# Altium project OBC-CubeSat-REV-A.PrjPcb
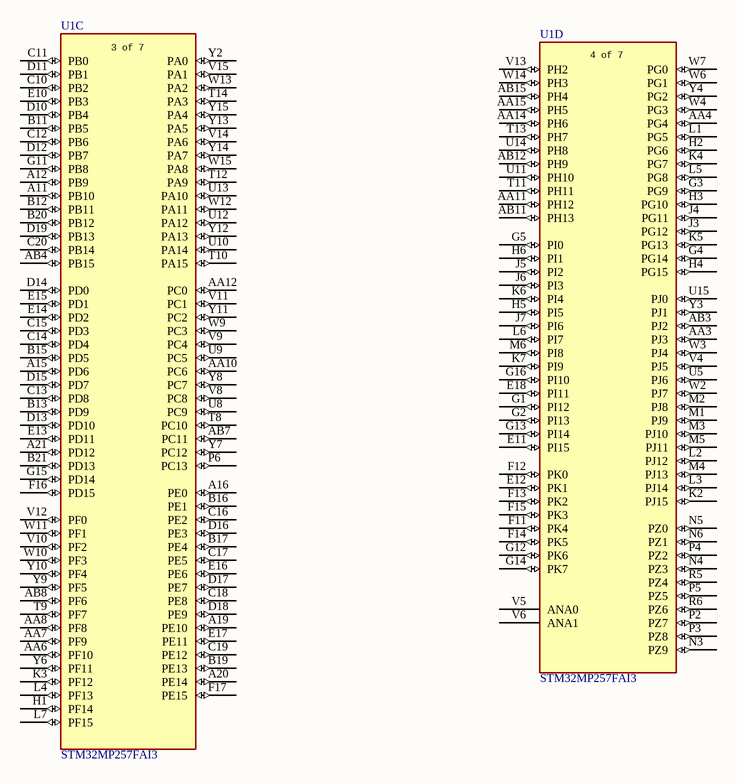
[diagram p0: MPU.SchDoc]
11 sheets, 184 parts. Net scope: global (net labels, ports and power ports of the same name join across sheets).
Board file: OBC-QM.PcbDoc
Sheets:
  MPU.SchDoc
  MPU-Power.SchDoc
  PMIC.SchDoc
  DebugInterface.SchDoc
  LPDDR4.SchDoc
  ETH-Debug.SchDoc
  RS485-Interface.SchDoc
  EXT-Camera-Interface.SchDoc
  Memory.SchDoc
  Sensors.SchDoc
  Harness.SchDoc

## Sheet MPU.SchDoc
size A4; SheetNumber: 1; SheetTotal: 11

### Parts
U1  STM32MP257FAI3  [TFBGA436_STM]  (parts C,D of 8)

### Nets

Not connected (* = marked no-connect by the designer): U1 A11(PB10) A12(PB9) A15(PD6) A16(PE0) A19(PE10) A20(PE14) A21(PD12) AA3(PJ3) AA4(PG4) AA6(PF10) AA7(PF9) AA8(PF8) AA10(PC6) AA11(PH12) AA12(PC0) AA14(PH6) AA15(PH5) AB3(PJ2) AB4(PB15) AB7(PC11) AB8(PF6) AB11(PH13) AB12(PH9) AB15(PH4) B11(PB5) B12(PB11) B13(PD9) B15(PD5) B16(PE1) B17(PE4) B19(PE13) B20(PB12) B21(PD13) C10(PB2) C11(PB0) C12(PB6) C13(PD8) C14(PD4) C15(PD3) C16(PE2) C17(PE5) C18(PE8) C19(PE12) C20(PB14) D10(PB4) D11(PB1) D12(PB7) D13(PD10) D14(PD0) D15(PD7) D16(PE3) D17(PE7) D18(PE9) D19(PB13) E10(PB3) E11(PI15) E12(PK1) E13(PD11) E14(PD2) E15(PD1) E16(PE6) E17(PE11) E18(PI11) F11(PK4) F12(PK0) F13(PK2) F14(PK5) F15(PK3) F16(PD15) F17(PE15) G1(PI12) G2(PI13) G3(PG9) G4(PG14) G5(PI0) G11(PB8) G12(PK6) G13(PI14) G14(PK7) G15(PD14) G16(PI10) H1(PF14) H2(PG6) H3(PG10) H4(PG15) H5(PI5) H6(PI1) J3(PG12) J4(PG11) J5(PI2) J6(PI3) J7(PI6) K2(PJ15) K3(PF12) K4(PG7) K5(PG13) K6(PI4) K7(PI9) L1(PG5) L2(PJ12) L3(PJ14) L4(PF13) L5(PG8) L6(PI7) L7(PF15) M1(PJ9) M2(PJ8) M3(PJ10) M4(PJ13) M5(PJ11) M6(PI8) N3(PZ9) N4(PZ3) N5(PZ0) N6(PZ1) P2(PZ7) P3(PZ8) P4(PZ2) P5(PZ5) P6(PC13) R5(PZ4) R6(PZ6) T8(PC10) T9(PF7) T10(PA15) T11(PH11) T12(PA9) T13(PH7) T14(PA3) U5(PJ6) U8(PC9) U9(PC5) U10(PA14) U11(PH10) U12(PA12) U13(PA10) U14(PH8) U15(PJ0) V4(PJ5) V5(ANA0) V6(ANA1) V8(PC8) V9(PC4) V10(PF2) V11(PC1) V12(PF0) V13(PH2) V14(PA6) V15(PA1) W2(PJ7) W3(PJ4) W4(PG3) W6(PG1) W7(PG0) W9(PC3) W10(PF3) W11(PF1) W12(PA11) W13(PA2) W14(PH3) W15(PA8) Y2(PA0) Y3(PJ1) Y4(PG2) Y6(PF11) Y7(PC12) Y8(PC7) Y9(PF5) Y10(PF4) Y11(PC2) Y12(PA13) Y13(PA5) Y14(PA7) Y15(PA4)

### Notes on the sheet
- (in symbol STM32MP257FAI3, part C) 3 of 7
- (in symbol STM32MP257FAI3, part D) 4 of 7

### Library data of the parts
U1 = STM32MP257FAI3: MPU with Dual Arm Cortex-A35 @1.5GHz, Cortex-M33 @400MHz, 3xEthernet (2+1 switch), 3xFD-CAN, LVDS/DSI, H.264, 3D GPU, AI/NN, Secure Boot, Cryptography, DRAM enc/dec, PKA; Manufacturer_Name: STMicroelectronics; Copyright: Copyright (C) 2025 Ultra Librarian. All rights reserved.; Manufacturer_Part_Number: STM32MP257FAI3; RefDes: RefDes; Type: Type

## Sheet MPU-Power.SchDoc
size A4; SheetNumber: 2; SheetTotal: 10
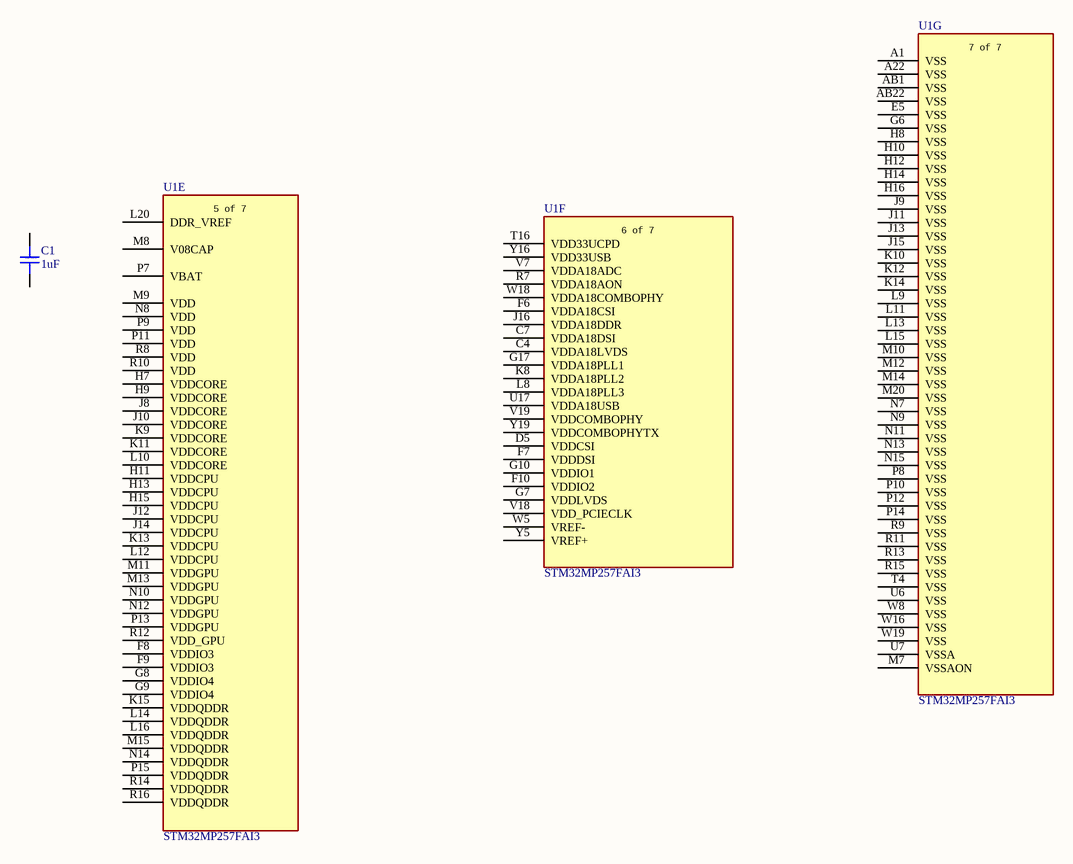
[diagram p1: MPU-Power.SchDoc]

### Parts
C1  1uF  [CAP_0402]
U1  STM32MP257FAI3  [TFBGA436_STM]  (parts E,F,G of 8)

### Nets

Not connected (* = marked no-connect by the designer): C1 1 2; U1 A1(VSS) A22(VSS) AB1(VSS) AB22(VSS) C4(VDDA18LVDS) C7(VDDA18DSI) D5(VDDCSI) E5(VSS) F6(VDDA18CSI) F7(VDDDSI) F8(VDDIO3) F9(VDDIO3) F10(VDDIO2) G6(VSS) G7(VDDLVDS) G8(VDDIO4) G9(VDDIO4) G10(VDDIO1) G17(VDDA18PLL1) H7(VDDCORE) H8(VSS) H9(VDDCORE) H10(VSS) H11(VDDCPU) H12(VSS) H13(VDDCPU) H14(VSS) H15(VDDCPU) H16(VSS) J8(VDDCORE) J9(VSS) J10(VDDCORE) J11(VSS) J12(VDDCPU) J13(VSS) J14(VDDCPU) J15(VSS) J16(VDDA18DDR) K8(VDDA18PLL2) K9(VDDCORE) K10(VSS) K11(VDDCORE) K12(VSS) K13(VDDCPU) K14(VSS) K15(VDDQDDR) L8(VDDA18PLL3) L9(VSS) L10(VDDCORE) L11(VSS) L12(VDDCPU) L13(VSS) L14(VDDQDDR) L15(VSS) L16(VDDQDDR) L20(DDR_VREF) M7(VSSAON) M8(V08CAP) M9(VDD) M10(VSS) M11(VDDGPU) M12(VSS) M13(VDDGPU) M14(VSS) M15(VDDQDDR) M20(VSS) N7(VSS) N8(VDD) N9(VSS) N10(VDDGPU) N11(VSS) N12(VDDGPU) N13(VSS) N14(VDDQDDR) N15(VSS) P7(VBAT) P8(VSS) P9(VDD) P10(VSS) P11(VDD) P12(VSS) P13(VDDGPU) P14(VSS) P15(VDDQDDR) R7(VDDA18AON) R8(VDD) R9(VSS) R10(VDD) R11(VSS) R12(VDD_GPU) R13(VSS) R14(VDDQDDR) R15(VSS) R16(VDDQDDR) T4(VSS) T16(VDD33UCPD) U6(VSS) U7(VSSA) U17(VDDA18USB) V7(VDDA18ADC) V18(VDD_PCIECLK) V19(VDDCOMBOPHY) W5(VREF-) W8(VSS) W16(VSS) W18(VDDA18COMBOPHY) W19(VSS) Y5(VREF+) Y16(VDD33USB) Y19(VDDCOMBOPHYTX)

### Notes on the sheet
- (in symbol Capacitor-SMD-0402) SMD 0402
- (in symbol STM32MP257FAI3, part E) 5 of 7
- (in symbol STM32MP257FAI3, part F) 6 of 7
- (in symbol STM32MP257FAI3, part G) 7 of 7

### Library data of the parts
C1 = Capacitor-SMD-0402: Capacitor SMD 0402 RATED
U1 = STM32MP257FAI3: as U1 on sheet MPU; Copyright: Copyright (C) 2025 Ultra Librarian. All rights reserved.; Manufacturer_Part_Number: STM32MP257FAI3; RefDes: RefDes; Type: Type

## Sheet PMIC.SchDoc
size A3; SheetNumber: 3; SheetTotal: 12
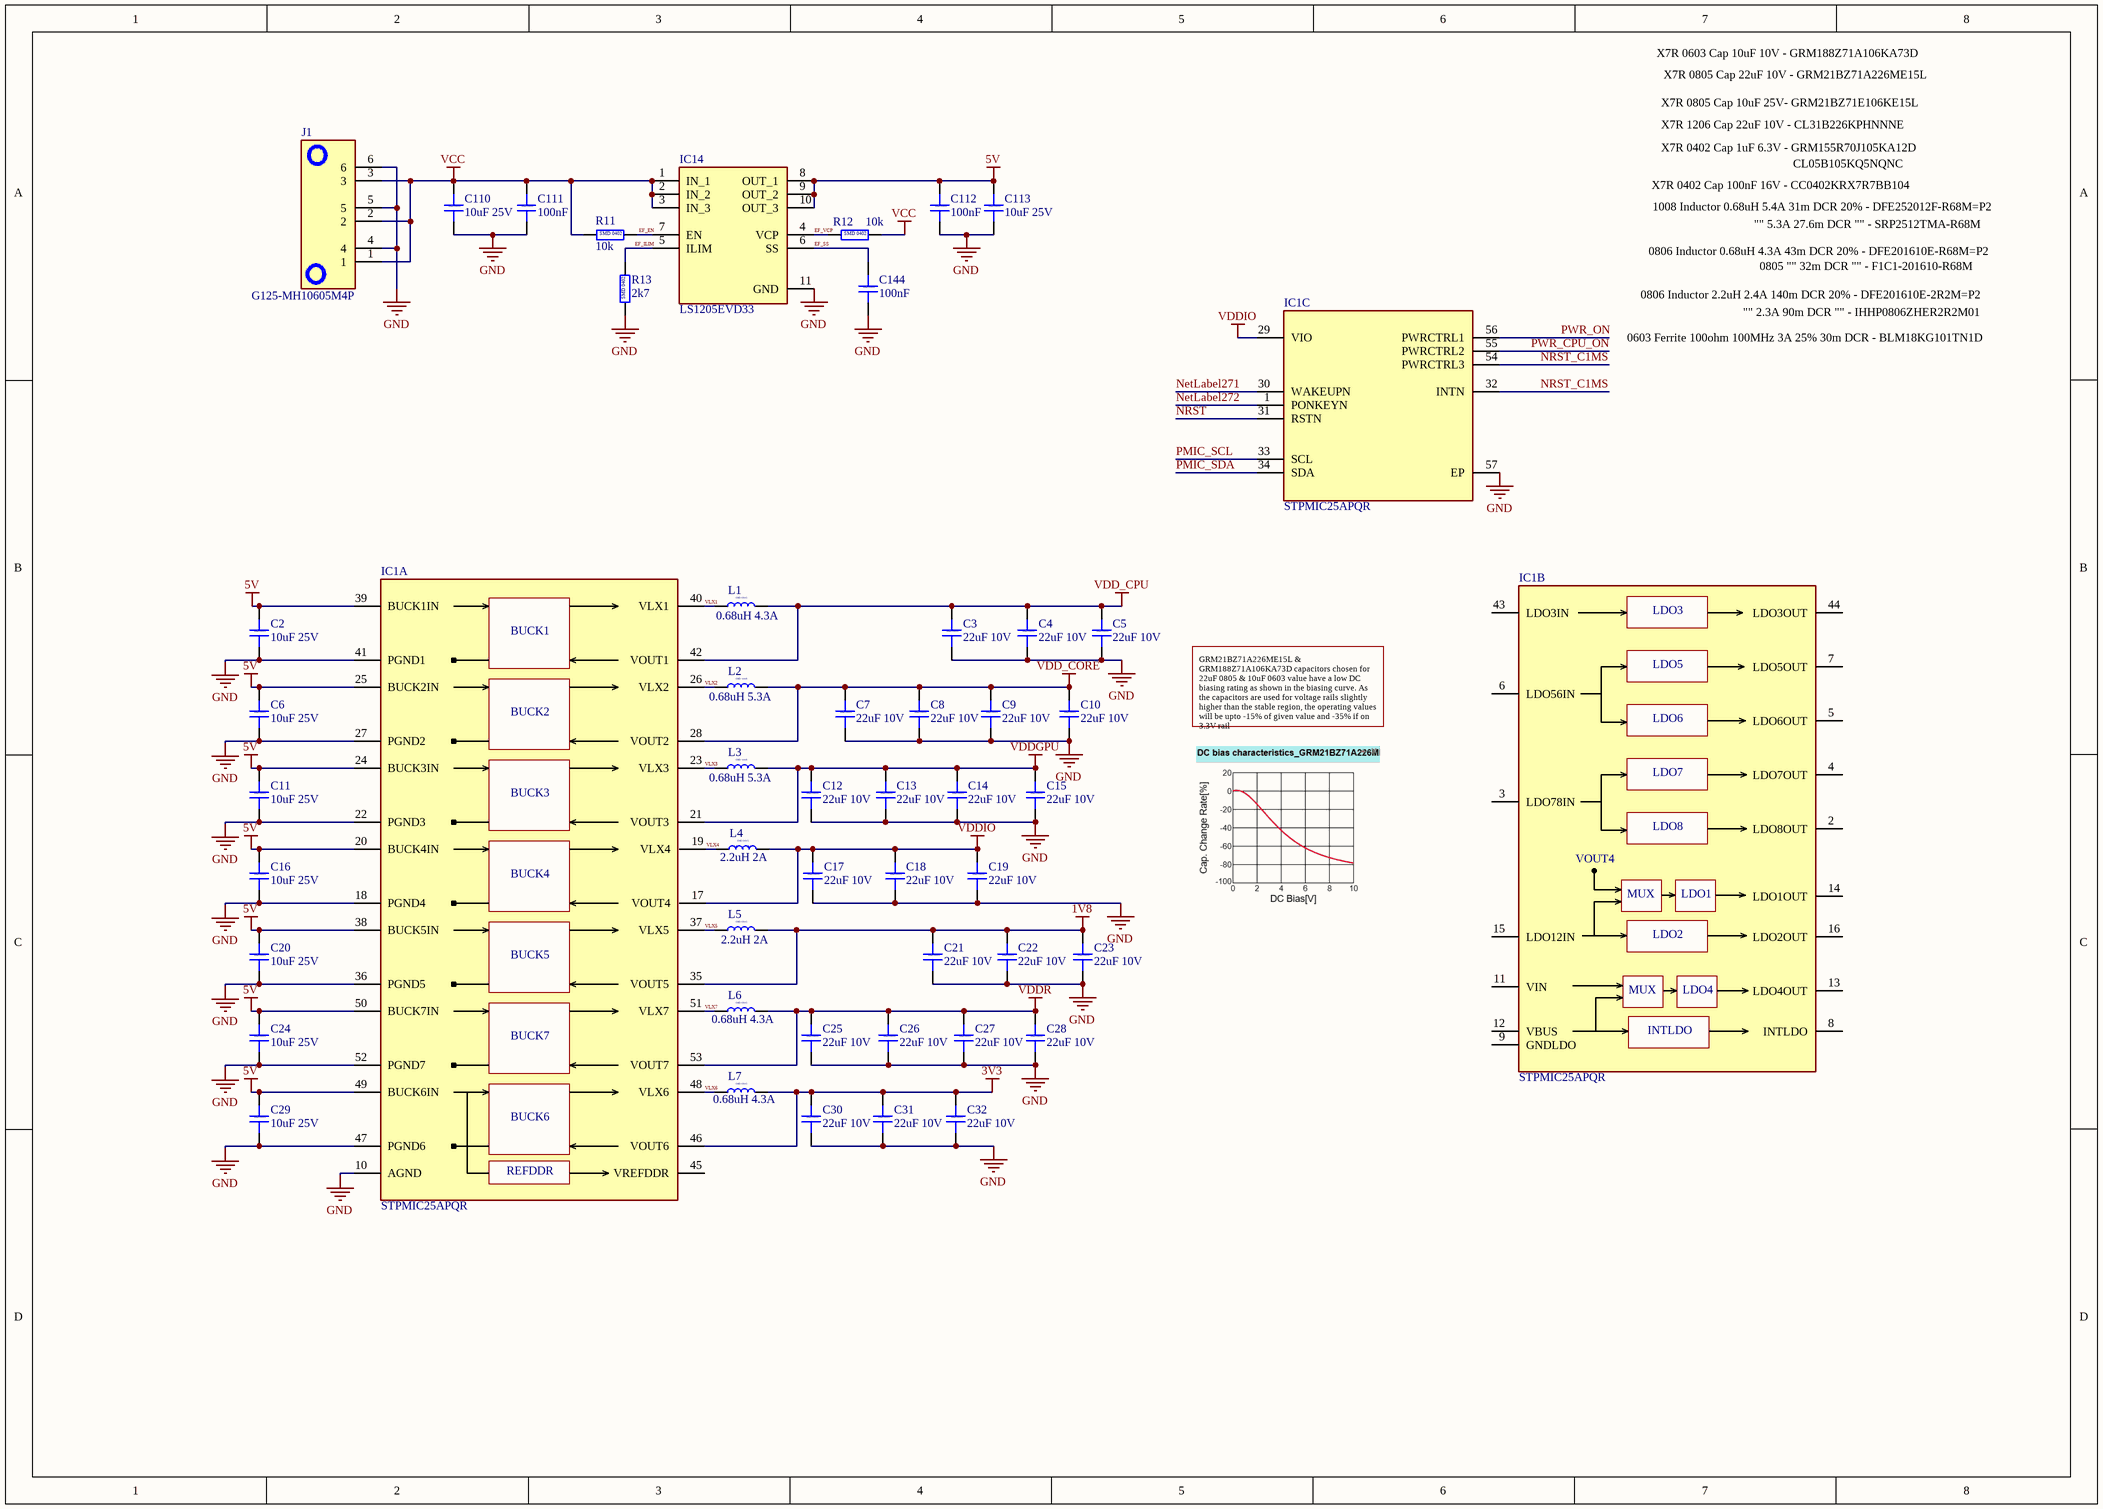
[diagram p2: PMIC.SchDoc]

### Parts
C2  10uF 25V  [CAP_0805]
C3  22uF 10V  [CAP_0805]
C4  22uF 10V  [CAP_0805]
C5  22uF 10V  [CAP_0805]
C6  10uF 25V  [CAP_0805]
C7  22uF 10V  [CAP_0805]
C8  22uF 10V  [CAP_0805]
C9  22uF 10V  [CAP_0805]
C10  22uF 10V  [CAP_0805]
C11  10uF 25V  [CAP_0805]
C12  22uF 10V  [CAP_0805]
C13  22uF 10V  [CAP_0805]
C14  22uF 10V  [CAP_0805]
C15  22uF 10V  [CAP_0805]
C16  10uF 25V  [CAP_0805]
C17  22uF 10V  [CAP_0805]
C18  22uF 10V  [CAP_0805]
C19  22uF 10V  [CAP_0805]
C20  10uF 25V  [CAP_0805]
C21  22uF 10V  [CAP_0805]
C22  22uF 10V  [CAP_0805]
C23  22uF 10V  [CAP_0805]
C24  10uF 25V  [CAP_0805]
C25  22uF 10V  [CAP_0805]
C26  22uF 10V  [CAP_0805]
C27  22uF 10V  [CAP_0805]
C28  22uF 10V  [CAP_0805]
C29  10uF 25V  [CAP_0805]
C30  22uF 10V  [CAP_0805]
C31  22uF 10V  [CAP_0805]
C32  22uF 10V  [CAP_0805]
C110  10uF 25V  [CAP_0805]
C111  100nF  [CAP_0402]
C112  100nF  [CAP_0402]
C113  10uF 25V  [CAP_0805]
C144  100nF  [CAP_0402]
IC1  STPMIC25APQR  [QFN40P650X650X90-57N-D]  (parts A,B,C of 3)
IC14  LS1205EVD33  [LS1205EVD33]
J1  G125-MH10605M4P  [G125-MH10605M4P_1]
L1  0.68uH 4.3A  [DFE2HCAH1R0MJ0L]
L2  0.68uH 5.3A  [1285ASH1R0MP2]
L3  0.68uH 5.3A  [1285ASH1R0MP2]
L4  2.2uH 2A  [DFE2HCAH1R0MJ0L]
L5  2.2uH 2A  [DFE2HCAH1R0MJ0L]
L6  0.68uH 4.3A  [DFE2HCAH1R0MJ0L]
L7  0.68uH 4.3A  [DFE2HCAH1R0MJ0L]
R11  10k  [RES_0402]
R12  10k  [RES_0402]
R13  2k7  [RES_0402]

### Nets
1V8: C21.1 C22.1 C23.1 IC1.35(VOUT5) L5.2
3V3: C30.1 C31.1 C32.1 IC1.46(VOUT6) L7.2
5V: C2.1 C6.1 C11.1 C16.1 C20.1 C24.1 C29.1 C112.1 C113.1 IC1.20(BUCK4IN) IC1.24(BUCK3IN) IC1.25(BUCK2IN) IC1.38(BUCK5IN) IC1.39(BUCK1IN) IC1.49(BUCK6IN) IC1.50(BUCK7IN) IC14.8(OUT_1) IC14.9(OUT_2) IC14.10(OUT_3)
GND: C2.2 C3.2 C4.2 C5.2 C6.2 C7.2 C8.2 C9.2 C10.2 C11.2 C12.2 C13.2 C14.2 C15.2 C16.2 C17.2 C18.2 C19.2 C20.2 C21.2 C22.2 C23.2 C24.2 C25.2 C26.2 C27.2 C28.2 C29.2 C30.2 C31.2 C32.2 C110.2 C111.2 C112.2 C113.2 C144.2 IC1.10(AGND) IC1.18(PGND4) IC1.22(PGND3) IC1.27(PGND2) IC1.36(PGND5) IC1.41(PGND1) IC1.47(PGND6) IC1.52(PGND7) IC1.57(EP) IC14.11(GND) J1.4 J1.5 J1.6 R13.1
VCC: C110.1 C111.1 IC14.1(IN_1) IC14.2(IN_2) IC14.3(IN_3) J1.1 J1.2 J1.3 R11.1 R12.2
VDD_CORE: C7.1 C8.1 C9.1 C10.1 IC1.28(VOUT2) L2.2
VDD_CPU: C3.1 C4.1 C5.1 IC1.42(VOUT1) L1.2
VDDGPU: C12.1 C13.1 C14.1 C15.1 IC1.21(VOUT3) L3.2
VDDIO: C17.1 C18.1 C19.1 IC1.17(VOUT4) IC1.29(VIO) L4.2
VDDR: C25.1 C26.1 C27.1 C28.1 IC1.53(VOUT7) L6.2
EF_EN: IC14.7(EN) R11.2
EF_ILIM: IC14.5(ILIM) R13.2
EF_SS: C144.1 IC14.6(SS)
EF_VCP: IC14.4(VCP) R12.1
NetLabel271: IC1.30(WAKEUPN)
NetLabel272: IC1.1(PONKEYN)
NRST: IC1.31(RSTN)
NRST_C1MS: IC1.32(INTN) IC1.54(PWRCTRL3)
PMIC_SCL: IC1.33(SCL)
PMIC_SDA: IC1.34(SDA)
PWR_CPU_ON: IC1.55(PWRCTRL2)
PWR_ON: IC1.56(PWRCTRL1)
VLX1: IC1.40(VLX1) L1.1
VLX2: IC1.26(VLX2) L2.1
VLX3: IC1.23(VLX3) L3.1
VLX4: IC1.19(VLX4) L4.1
VLX5: IC1.37(VLX5) L5.1
VLX6: IC1.48(VLX6) L7.1
VLX7: IC1.51(VLX7) L6.1

Not connected (* = marked no-connect by the designer): IC1 2(LDO8OUT) 3(LDO78IN) 4(LDO7OUT) 5(LDO6OUT) 6(LDO56IN) 7(LDO5OUT) 8(INTLDO) 9(GNDLDO) 11(VIN) 12(VBUS) 13(LDO4OUT) 14(LDO1OUT) 15(LDO12IN) 16(LDO2OUT) 43(LDO3IN) 44(LDO3OUT) 45(VREFDDR)

### Notes on the sheet
- X7R 0603 Cap 10uF 10V - GRM188Z71A106KA73D
- X7R 0805 Cap 10uF 25V- GRM21BZ71E106KE15L
- X7R 0805 Cap 22uF 10V - GRM21BZ71A226ME15L
- X7R 1206 Cap 22uF 10V - CL31B226KPHNNNE
- X7R 0402 Cap 1uF 6.3V - GRM155R70J105KA12D
- CL05B105KQ5NQNC
- X7R 0402 Cap 100nF 16V - CC0402KRX7R7BB104
- 1008 Inductor 0.68uH 5.4A 31m DCR 20% - DFE252012F-R68M=P2
- "" 5.3A 27.6m DCR "" - SRP2512TMA-R68M
- 0806 Inductor 2.2uH 2.4A 140m DCR 20% - DFE201610E-2R2M=P2
- 0806 Inductor 0.68uH 4.3A 43m DCR 20% - DFE201610E-R68M=P2
- "" 2.3A 90m DCR "" - IHHP0806ZHER2R2M01
- 0805 "" 32m DCR "" - F1C1-201610-R68M
- 0603 Ferrite 100ohm 100MHz 3A 25% 30m DCR - BLM18KG101TN1D
- GRM21BZ71A226ME15L & GRM188Z71A106KA73D capacitors chosen for 22uF 0805 & 10uF 0603 value have a low DC biasing rating as shown in the biasing curve. As the capacitors are used for voltage rails slightly higher than the stable region, the operating values will be upto -15% of given value and -35% if on 3.3V rail
- (in symbol Capacitor-SMD-0402) SMD 0402
- (in symbol Capacitor-SMD-0805) SMD 0805
- (in symbol Inductor-SMD-RF-0806/0805) SMD 0805
- (in symbol Inductor-SMD-RF-1008) SMD 1008
- (in symbol Resistor-SMD-0402) SMD 0402
- (in symbol STPMIC25APQR, part A) BUCK1; BUCK2; BUCK3; BUCK4; BUCK5; BUCK7; BUCK6; REFDDR
- (in symbol STPMIC25APQR, part B) LDO3; LDO5; LDO6; LDO7; LDO8; MUX; LDO1; LDO2; LDO4

### Library data of the parts
C2-C32 C110 C113 = Capacitor-SMD-0805: Capacitor SMD 0805 RATED
C111 C112 C144 = Capacitor-SMD-0402: Capacitor SMD 0402 RATED
IC1 = STPMIC25APQR: Integrated Circuit; Manufacturer_Name: STMicroelectronics; Datasheet Link: https://www.st.com/resource/en/datasheet/stpmic25.pdf; Height: 0.9mm; Manufacturer_Part_Number: STPMIC25APQR; Mouser Part Number: 511-STPMIC25APQR; Mouser Price/Stock: https://www.mouser.co.uk/ProductDetail/STMicroelectronics/STPMIC25APQR?qs=jRuttqqUwMR8b%2FyHW8MhFQ%3D%3D; Arrow Part Number: STPMIC25APQR; Arrow Price/Stock: https://www.arrow.com/en/products/stpmic25apqr/stmicroelectronics?utm_currency=USD&region=europe
IC14 = LS1205EVD33: Integrated Circuit; Manufacturer_Name: LITTELFUSE; Datasheet Link: https://www.littelfuse.com/media?resourcetype=datasheets&itemid=b40a8809-c1ad-459d-a34c-84532dbddcb7&filename=littelfuse-protection-ic-ls1205exd33--datasheet; Height: 0.8mm; Manufacturer_Part_Number: LS1205EVD33; Mouser Part Number: 576-LS1205EVD33; Mouser Price/Stock: https://www.mouser.co.uk/ProductDetail/Littelfuse/LS1205EVD33?qs=4ASt3YYao0VRtislHe5uQQ%3D%3D; Arrow Part Number: LS1205EVD33; Arrow Price/Stock: https://www.arrow.com/en/products/ls1205evd33/littelfuse?utm_currency=USD&region=nac
J1 = G125-MH10605M4P: Connector; Manufacturer_Name: Harwin; Datasheet Link: https://content.harwin.com/m/667f1be9427fb768/original/DRG-02921-Technical-Drawing-Datasheet-G125-MH1XX05M4P-pdf.pdf; Height: 5.3mm; Manufacturer_Part_Number: G125-MH10605M4P; Mouser Part Number: 855-G125MH1065M4PM4P; Mouser Price/Stock: https://www.mouser.co.uk/ProductDetail/Harwin/G125-MH10605M4P?qs=vHuUswq2%252BswF07IXFR1W6A%3D%3D
L1 L4-L7 = Inductor-SMD-RF-0806/0805: Inductor SMD 0805
L2 L3 = Inductor-SMD-RF-1008: Inductor SMD 1008
R11-R13 = Resistor-SMD-0402: Resistor SMD 0402 RATED

## Sheet DebugInterface.SchDoc
size A4; SheetNumber: 4; SheetTotal: 10
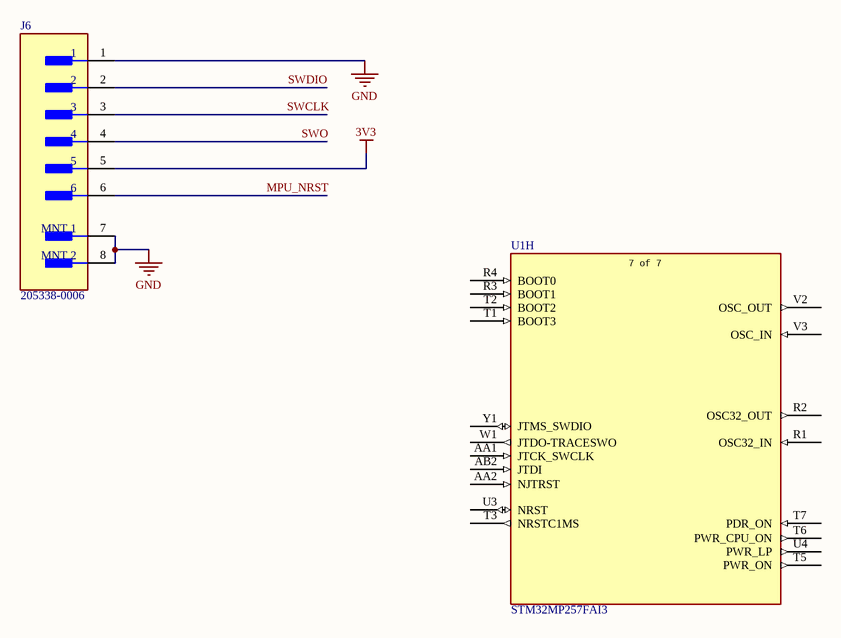
[diagram p3: DebugInterface.SchDoc]

### Parts
J6  205338-0006  [FP-2053380006-MFG]
U1  STM32MP257FAI3  [TFBGA436_STM]  (part H of 8)

### Nets
3V3: J6.5
GND: J6.1 J6.7(MNT_1) J6.8(MNT_2)
MPU_NRST: J6.6
SWCLK: J6.3
SWDIO: J6.2
SWO: J6.4

Not connected (* = marked no-connect by the designer): U1 AA1(JTCK_SWCLK) AA2(NJTRST) AB2(JTDI) R1(OSC32_IN) R2(OSC32_OUT) R3(BOOT1) R4(BOOT0) T1(BOOT3) T2(BOOT2) T3(NRSTC1MS) T5(PWR_ON) T6(PWR_CPU_ON) T7(PDR_ON) U3(NRST) U4(PWR_LP) V2(OSC_OUT) V3(OSC_IN) W1(JTDO-TRACESWO) Y1(JTMS_SWDIO)

### Notes on the sheet
- (in symbol STM32MP257FAI3, part H) 7 of 7

### Library data of the parts
J6 = CMP-00257-108204701-1: 205338-0006 Connector Shrouded Header Positive Lock 6 Position 2mm Pitch Right Angle Surface Mount T/R; Manufacturer Lifecycle Status: ACTIVE; Number of Circuits: 6; Gender: Male; NexarPartId: 108204701; Contact Plating: Gold; Lifecycle Status: Production; Schedule B: 8536694040; RoHS: Compliant; Number of Rows: 1; Country of Origin: MY; Orientation: Right Angle
U1 = STM32MP257FAI3: as U1 on sheet MPU; Copyright: Copyright (C) 2025 Ultra Librarian. All rights reserved.; Manufacturer_Part_Number: STM32MP257FAI3; RefDes: RefDes; Type: Type

## Sheet LPDDR4.SchDoc
size Tabloid; SheetNumber: 5; SheetTotal: 11
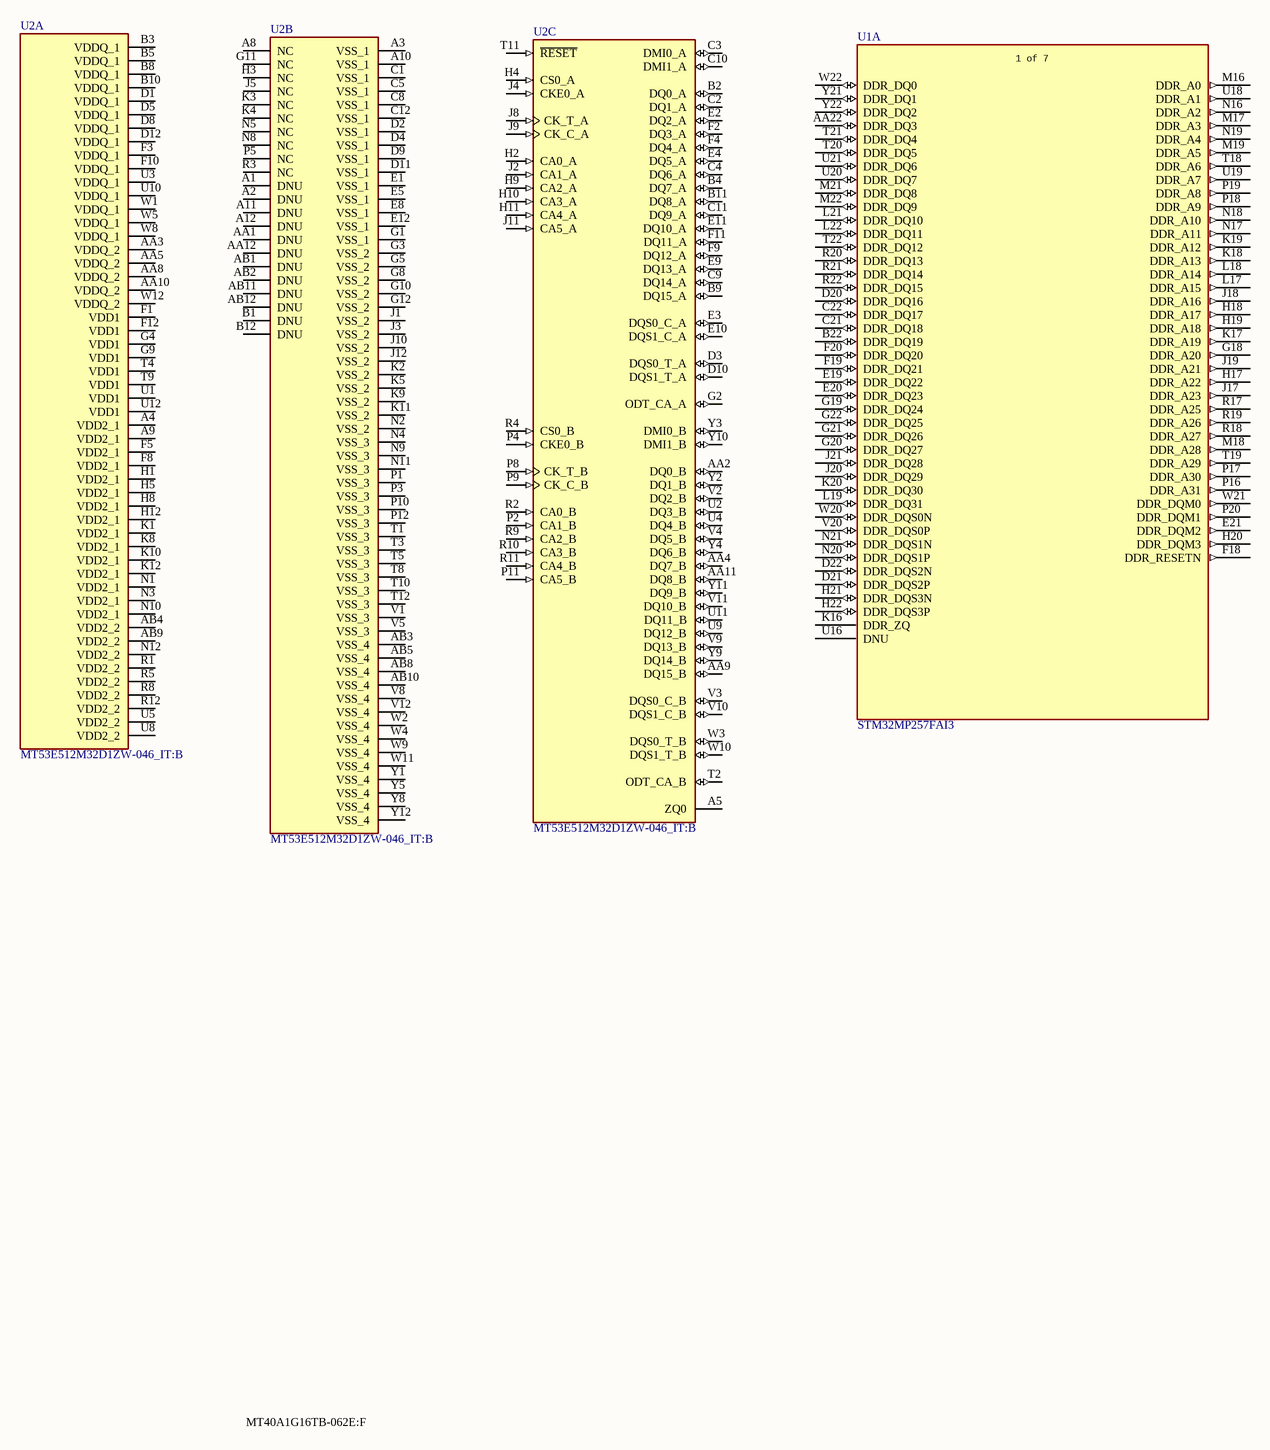
[diagram p4: LPDDR4.SchDoc]

### Parts
U1  STM32MP257FAI3  [TFBGA436_STM]  (part A of 8)
U2  MT53E512M32D1ZW-046_IT:B  [BGA200C65P12X22_1000X1450X105]  (parts A,B,C of 3)

### Nets

Not connected (* = marked no-connect by the designer): U1 AA22(DDR_DQ3) B22(DDR_DQ19) C21(DDR_DQ18) C22(DDR_DQ17) D20(DDR_DQ16) D21(DDR_DQS2P) D22(DDR_DQS2N) E19(DDR_DQ22) E20(DDR_DQ23) E21(DDR_DQM2) F18(DDR_RESETN) F19(DDR_DQ21) F20(DDR_DQ20) G18(DDR_A20) G19(DDR_DQ24) G20(DDR_DQ27) G21(DDR_DQ26) G22(DDR_DQ25) H17(DDR_A22) H18(DDR_A17) H19(DDR_A18) H20(DDR_DQM3) H21(DDR_DQS3N) H22(DDR_DQS3P) J17(DDR_A23) J18(DDR_A16) J19(DDR_A21) J20(DDR_DQ29) J21(DDR_DQ28) K16(DDR_ZQ) K17(DDR_A19) K18(DDR_A13) K19(DDR_A12) K20(DDR_DQ30) L17(DDR_A15) L18(DDR_A14) L19(DDR_DQ31) L21(DDR_DQ10) L22(DDR_DQ11) M16(DDR_A0) M17(DDR_A3) M18(DDR_A28) M19(DDR_A5) M21(DDR_DQ8) M22(DDR_DQ9) N16(DDR_A2) N17(DDR_A11) N18(DDR_A10) N19(DDR_A4) N20(DDR_DQS1P) N21(DDR_DQS1N) P16(DDR_A31) P17(DDR_A30) P18(DDR_A9) P19(DDR_A8) P20(DDR_DQM1) R17(DDR_A25) R18(DDR_A27) R19(DDR_A26) R20(DDR_DQ13) R21(DDR_DQ14) R22(DDR_DQ15) T18(DDR_A6) T19(DDR_A29) T20(DDR_DQ5) T21(DDR_DQ4) T22(DDR_DQ12) U16(DNU) U18(DDR_A1) U19(DDR_A7) U20(DDR_DQ7) U21(DDR_DQ6) V20(DDR_DQS0P) W20(DDR_DQS0N) W21(DDR_DQM0) W22(DDR_DQ0) Y21(DDR_DQ1) Y22(DDR_DQ2); U2 A1(DNU) A2(DNU) A3(VSS_1) A4(VDD2_1) A5(ZQ0) A8(NC) A9(VDD2_1) A10(VSS_1) A11(DNU) A12(DNU) AA1(DNU) AA2(DQ0_B) AA3(VDDQ_2) AA4(DQ7_B) AA5(VDDQ_2) AA8(VDDQ_2) AA9(DQ15_B) AA10(VDDQ_2) AA11(DQ8_B) AA12(DNU) AB1(DNU) AB2(DNU) AB3(VSS_4) AB4(VDD2_2) AB5(VSS_4) AB8(VSS_4) AB9(VDD2_2) AB10(VSS_4) AB11(DNU) AB12(DNU) B1(DNU) B2(DQ0_A) B3(VDDQ_1) B4(DQ7_A) B5(VDDQ_1) B8(VDDQ_1) B9(DQ15_A) B10(VDDQ_1) B11(DQ8_A) B12(DNU) C1(VSS_1) C2(DQ1_A) C3(DMI0_A) C4(DQ6_A) C5(VSS_1) C8(VSS_1) C9(DQ14_A) C10(DMI1_A) C11(DQ9_A) C12(VSS_1) D1(VDDQ_1) D2(VSS_1) D3(DQS0_T_A) D4(VSS_1) D5(VDDQ_1) D8(VDDQ_1) D9(VSS_1) D10(DQS1_T_A) D11(VSS_1) D12(VDDQ_1) E1(VSS_1) E2(DQ2_A) E3(DQS0_C_A) E4(DQ5_A) E5(VSS_1) E8(VSS_1) E9(DQ13_A) E10(DQS1_C_A) E11(DQ10_A) E12(VSS_1) F1(VDD1) F2(DQ3_A) F3(VDDQ_1) F4(DQ4_A) F5(VDD2_1) F8(VDD2_1) F9(DQ12_A) F10(VDDQ_1) F11(DQ11_A) F12(VDD1) G1(VSS_1) G2(ODT_CA_A) G3(VSS_2) G4(VDD1) G5(VSS_2) G8(VSS_2) G9(VDD1) G10(VSS_2) G11(NC) G12(VSS_2) H1(VDD2_1) H2(CA0_A) H3(NC) H4(CS0_A) H5(VDD2_1) H8(VDD2_1) H9(CA2_A) H10(CA3_A) H11(CA4_A) H12(VDD2_1) J1(VSS_2) J2(CA1_A) J3(VSS_2) J4(CKE0_A) J5(NC) J8(CK_T_A) J9(CK_C_A) J10(VSS_2) J11(CA5_A) J12(VSS_2) K1(VDD2_1) K2(VSS_2) K3(NC) K4(NC) K5(VSS_2) K8(VDD2_1) K9(VSS_2) K10(VDD2_1) K11(VSS_2) K12(VDD2_1) N1(VDD2_1) N2(VSS_2) N3(VDD2_1) N4(VSS_3) N5(NC) N8(NC) N9(VSS_3) N10(VDD2_1) N11(VSS_3) N12(VDD2_2) P1(VSS_3) P2(CA1_B) P3(VSS_3) P4(CKE0_B) P5(NC) P8(CK_T_B) P9(CK_C_B) P10(VSS_3) P11(CA5_B) P12(VSS_3) R1(VDD2_2) R2(CA0_B) R3(NC) R4(CS0_B) R5(VDD2_2) R8(VDD2_2) R9(CA2_B) R10(CA3_B) R11(CA4_B) R12(VDD2_2) T1(VSS_3) T2(ODT_CA_B) T3(VSS_3) T4(VDD1) T5(VSS_3) T8(VSS_3) T9(VDD1) T10(VSS_3) T11(~{RESET}) T12(VSS_3) U1(VDD1) U2(DQ3_B) U3(VDDQ_1) U4(DQ4_B) U5(VDD2_2) U8(VDD2_2) U9(DQ12_B) U10(VDDQ_1) U11(DQ11_B) U12(VDD1) V1(VSS_3) V2(DQ2_B) V3(DQS0_C_B) V4(DQ5_B) V5(VSS_3) V8(VSS_4) V9(DQ13_B) V10(DQS1_C_B) V11(DQ10_B) V12(VSS_4) W1(VDDQ_1) W2(VSS_4) W3(DQS0_T_B) W4(VSS_4) W5(VDDQ_1) W8(VDDQ_1) W9(VSS_4) W10(DQS1_T_B) W11(VSS_4) W12(VDDQ_2) Y1(VSS_4) Y2(DQ1_B) Y3(DMI0_B) Y4(DQ6_B) Y5(VSS_4) Y8(VSS_4) Y9(DQ14_B) Y10(DMI1_B) Y11(DQ9_B) Y12(VSS_4)

### Notes on the sheet
- MT40A1G16TB-062E:F
- (in symbol STM32MP257FAI3, part A) 1 of 7

### Library data of the parts
U1 = STM32MP257FAI3: as U1 on sheet MPU; Copyright: Copyright (C) 2025 Ultra Librarian. All rights reserved.; Manufacturer_Part_Number: STM32MP257FAI3; RefDes: RefDes; Type: Type
U2 = MT53E512M32D1ZW-046_IT:B: SDRAM - Mobile LPDDR4 Memory IC 16Gbit Parallel 2.133 GHz 3.5 ns 200-TFBGA (10x14.5); MF: Micron Technology; MP: MT53E512M32D1ZW-046 IT:B; SnapEDA_Link: https://www.snapeda.com/parts/MT53E512M32D1ZW-046%20IT:B/Micron/view-part/?ref=snap; Package: None; Value: *; Check_prices: https://www.snapeda.com/parts/MT53E512M32D1ZW-046%20IT:B/Micron/view-part/?ref=eda

## Sheet ETH-Debug.SchDoc
size OrCAD B; SheetNumber: 6; SheetTotal: 10
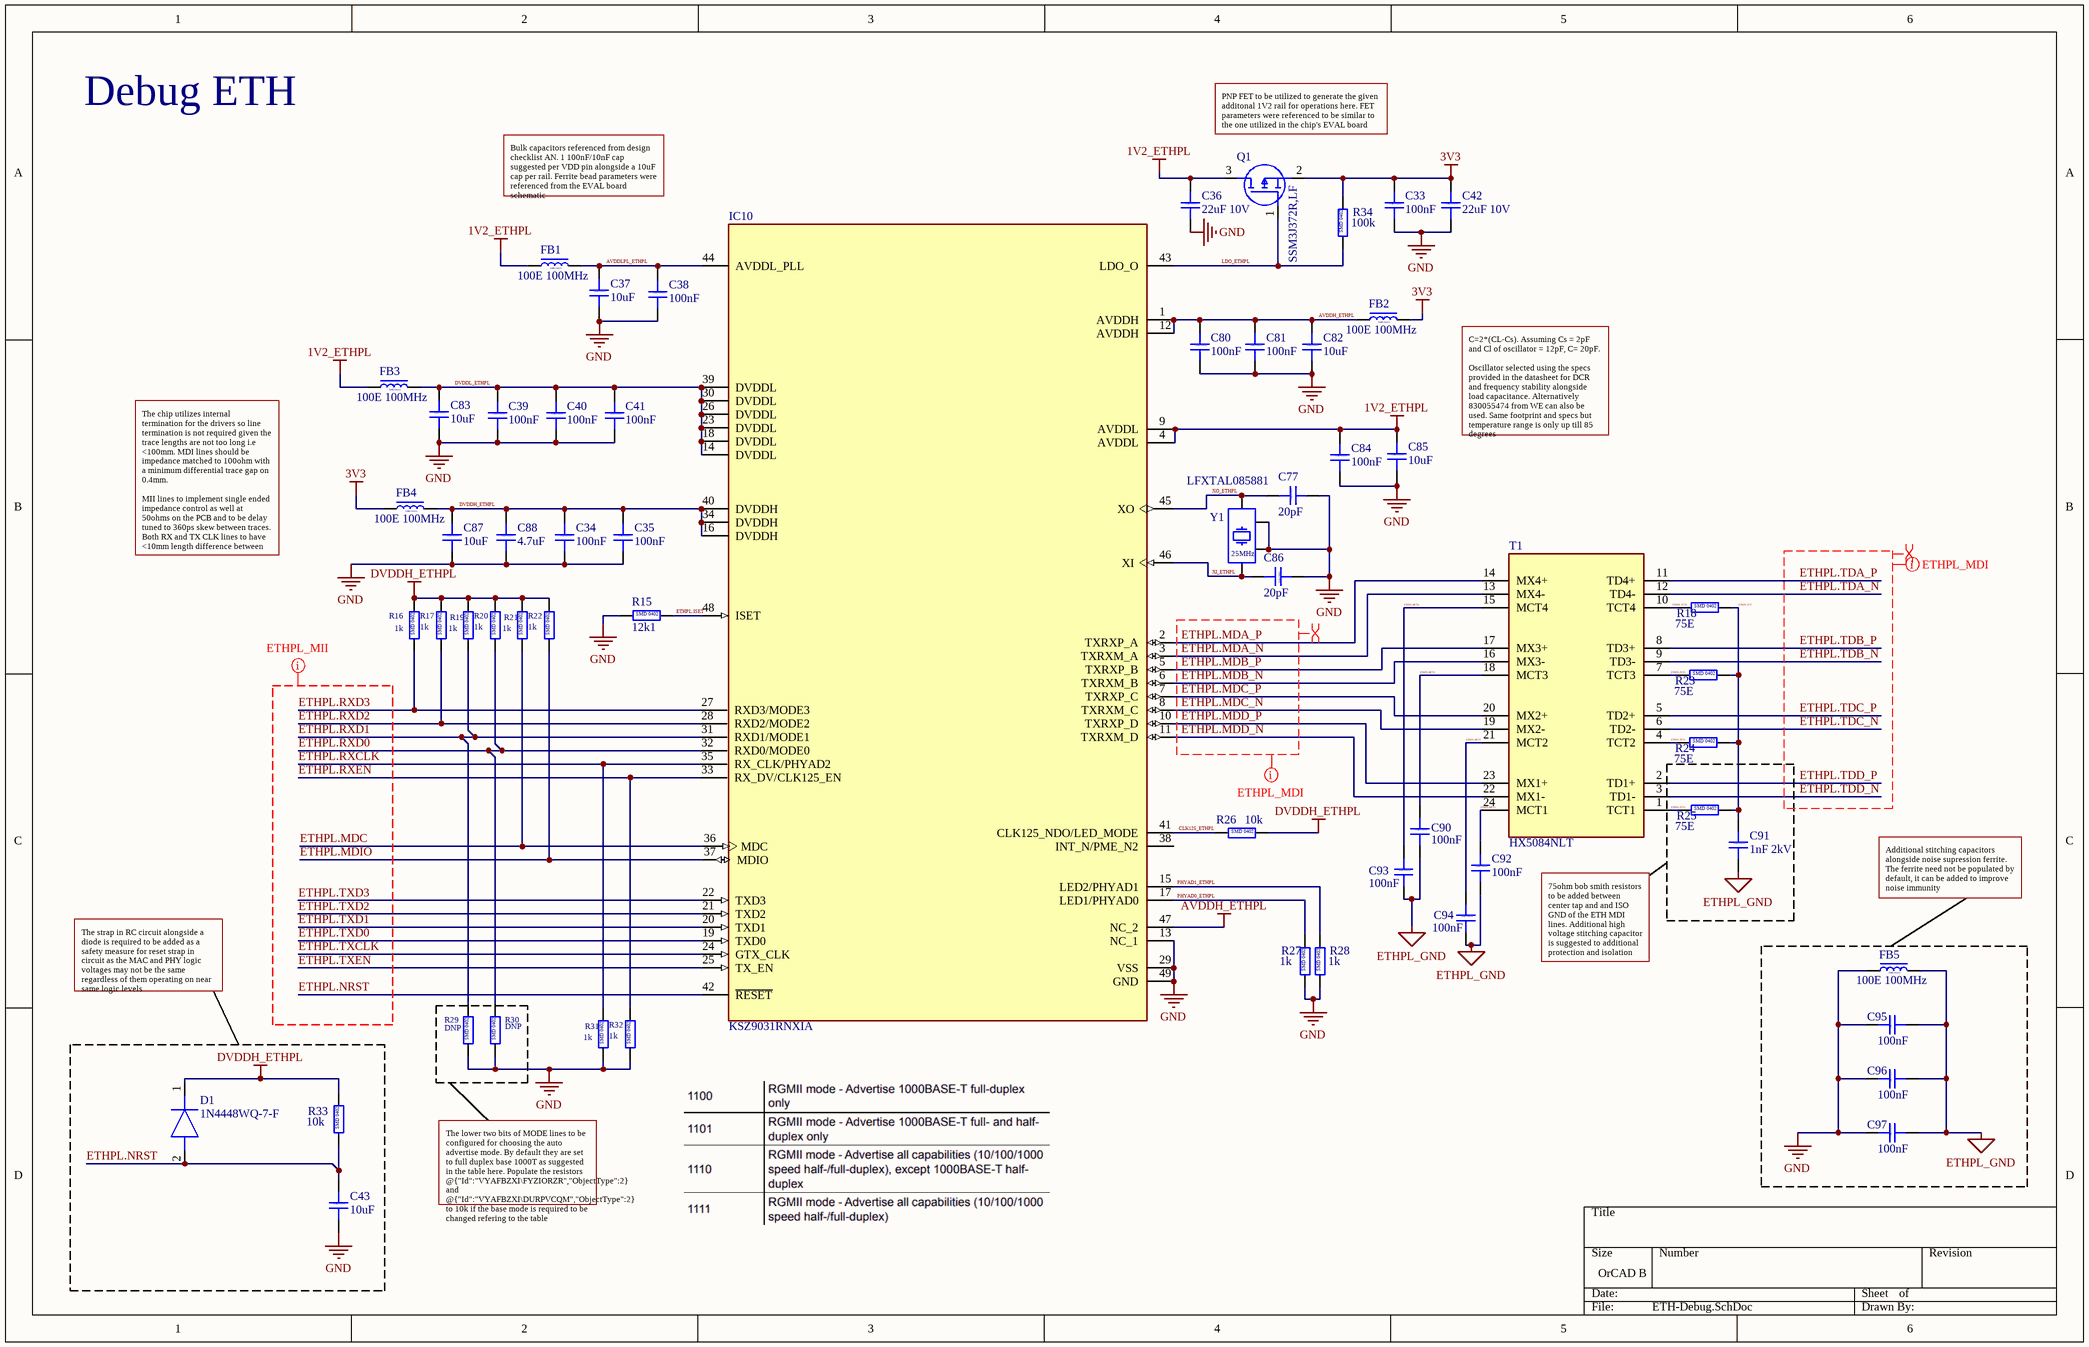
[diagram p5: ETH-Debug.SchDoc]

### Parts
C33  100nF  [CAP_0402]
C34  100nF  [CAP_0402]
C35  100nF  [CAP_0402]
C36  22uF 10V  [CAP_0805]
C37  10uF  [CAP_0603]
C38  100nF  [CAP_0402]
C39  100nF  [CAP_0402]
C40  100nF  [CAP_0402]
C41  100nF  [CAP_0402]
C42  22uF 10V  [CAP_0805]
C43  10uF  [CAP_0603]
C77  20pF  [CAP_0402]
C80  100nF  [CAP_0402]
C81  100nF  [CAP_0402]
C82  10uF  [CAP_0603]
C83  10uF  [CAP_0603]
C84  100nF  [CAP_0402]
C85  10uF  [CAP_0603]
C86  20pF  [CAP_0402]
C87  10uF  [CAP_0603]
C88  4.7uF  [CAP_0603]
C90  100nF  [CAP_0402]
C91  1nF 2kV  [CAP_0402]
C92  100nF  [CAP_0402]
C93  100nF  [CAP_0402]
C94  100nF  [CAP_0402]
C95  100nF  [CAP_0402]
C96  100nF  [CAP_0402]
C97  100nF  [CAP_0402]
D1  1N4448WQ-7-F  [SOD3716X135N]
FB1  100E 100MHz  [FB_0603]
FB2  100E 100MHz  [FB_0603]
FB3  100E 100MHz  [FB_0603]
FB4  100E 100MHz  [FB_0603]
FB5  100E 100MHz  [FB_0603]
IC10  KSZ9031RNXIA  [QFN50P700X700X90-49N]
Q1  SSM3J372R,LF  [SSM3J372RLF]
R15  12k1  [RES_0402]
R16  1k  [RES_0402]
R17  1k  [RES_0402]
R18  75E  [RES_0402]
R19  1k  [RES_0402]
R20  1k  [RES_0402]
R21  1k  [RES_0402]
R22  1k  [RES_0402]
R23  75E  [RES_0402]
R24  75E  [RES_0402]
R25  75E  [RES_0402]
R26  10k  [RES_0402]
R27  1k  [RES_0402]
R28  1k  [RES_0402]
R29  DNP  [RES_0402]
R30  DNP  [RES_0402]
R31  1k  [RES_0402]
R32  1k  [RES_0402]
R33  10k  [RES_0402]
R34  100k  [RES_0402]
T1  HX5084NLT  [HX5084NLT]
Y1  LFXTAL085881  [CRY-SMD-3225]

### Nets
1V2_ETHPL: C36.1 C84.1 C85.1 FB1.1 FB3.1 IC10.4(AVDDL) IC10.9(AVDDL) Q1.3(D)
3V3: C33.1 C42.1 FB2.2 FB4.1 Q1.2(S) R34.2
AVDDH_ETHPL: C80.1 C81.1 C82.1 FB2.1 IC10.1(AVDDH) IC10.12(AVDDH) IC10.47(NC_2)
DVDDH_ETHPL: C34.1 C35.1 C87.1 C88.1 D1.1(K) FB4.2 IC10.16(DVDDH) IC10.34(DVDDH) IC10.40(DVDDH) R16.2 R17.2 R19.2 R20.2 R21.2 R22.2 R26.2 R33.2
ETHPL_GND: C90.2 C91.2 C92.2 C93.2 C94.2 C95.2 C96.2 C97.2 FB5.2
GND: C33.2 C34.2 C35.2 C36.2 C37.2 C38.2 C39.2 C40.2 C41.2 C42.2 C43.2 C77.2 C80.2 C81.2 C82.2 C83.2 C84.2 C85.2 C86.1 C87.2 C88.2 C95.1 C96.1 C97.1 FB5.1 IC10.13(NC_1) IC10.29(VSS) IC10.49(GND) R15.1 R27.1 R28.1 R29.1 R30.1 R31.1 R32.1 Y1.2 Y1.4
AVDDLPL_ETHPL: C37.1 C38.1 FB1.2 IC10.44(AVDDL_PLL)
CLK125_ETHPL: IC10.41(CLK125_NDO/LED_MODE) R26.1
DVDDL_ETHPL: C39.1 C40.1 C41.1 C83.1 FB3.2 IC10.14(DVDDL) IC10.18(DVDDL) IC10.23(DVDDL) IC10.26(DVDDL) IC10.30(DVDDL) IC10.39(DVDDL)
ETHPL.ISET: IC10.48(ISET) R15.2
ETHPL.MCT1: C92.1 T1.24(MCT1)
ETHPL.MCT2: C94.1 T1.21(MCT2)
ETHPL.MCT3: C90.1 T1.18(MCT3)
ETHPL.MCT4: C93.1 T1.15(MCT4)
ETHPL.MDA_N: IC10.3(TXRXM_A) T1.13(MX4-)
ETHPL.MDA_P: IC10.2(TXRXP_A) T1.14(MX4+)
ETHPL.MDB_N: IC10.6(TXRXM_B) T1.16(MX3-)
ETHPL.MDB_P: IC10.5(TXRXP_B) T1.17(MX3+)
ETHPL.MDC: IC10.36(MDC) R21.1
ETHPL.MDC_N: IC10.8(TXRXM_C) T1.19(MX2-)
ETHPL.MDC_P: IC10.7(TXRXP_C) T1.20(MX2+)
ETHPL.MDD_N: IC10.11(TXRXM_D) T1.22(MX1-)
ETHPL.MDD_P: IC10.10(TXRXP_D) T1.23(MX1+)
ETHPL.MDIO: IC10.37(MDIO) R22.1
ETHPL.NRST: C43.1 D1.2(A) IC10.42(~{RESET}) R33.1
ETHPL.RXCLK: IC10.35(RX_CLK/PHYAD2) R31.2
ETHPL.RXD0: IC10.32(RXD0/MODE0) R20.1 R30.2
ETHPL.RXD1: IC10.31(RXD1/MODE1) R19.1 R29.2
ETHPL.RXD2: IC10.28(RXD2/MODE2) R17.1
ETHPL.RXD3: IC10.27(RXD3/MODE3) R16.1
ETHPL.RXEN: IC10.33(RX_DV/CLK125_EN) R32.2
ETHPL.TCT: C91.1 R18.2 R23.2 R24.2 R25.2
ETHPL.TCT1: R25.1 T1.1(TCT1)
ETHPL.TCT2: R24.1 T1.4(TCT2)
ETHPL.TCT3: R23.1 T1.7(TCT3)
ETHPL.TCT4: R18.1 T1.10(TCT4)
ETHPL.TDA_N: T1.12(TD4-)
ETHPL.TDA_P: T1.11(TD4+)
ETHPL.TDB_N: T1.9(TD3-)
ETHPL.TDB_P: T1.8(TD3+)
ETHPL.TDC_N: T1.6(TD2-)
ETHPL.TDC_P: T1.5(TD2+)
ETHPL.TDD_N: T1.3(TD1-)
ETHPL.TDD_P: T1.2(TD1+)
ETHPL.TXCLK: IC10.24(GTX_CLK)
ETHPL.TXD0: IC10.19(TXD0)
ETHPL.TXD1: IC10.20(TXD1)
ETHPL.TXD2: IC10.21(TXD2)
ETHPL.TXD3: IC10.22(TXD3)
ETHPL.TXEN: IC10.25(TX_EN)
LDO_ETHPL: IC10.43(LDO_O) Q1.1(G) R34.1
PHYAD0_ETHPL: IC10.17(LED1/PHYAD0) R27.2
PHYAD1_ETHPL: IC10.15(LED2/PHYAD1) R28.2
XI_ETHPL: C86.2 IC10.46(XI) Y1.1
XO_ETHPL: C77.1 IC10.45(XO) Y1.3

Not connected (* = marked no-connect by the designer): IC10 38(INT_N/PME_N2)

### Layout directives
net class ETHPL_MII; rule Maximum Via Count Constraint [Max Count = 2]; rule Matched Net Lengths [Delay Tolerance = 360ps]: ETHPL.MDC, ETHPL.MDIO, ETHPL.NRST, ETHPL.RXCLK, ETHPL.RXD0, ETHPL.RXD1, ETHPL.RXD2, ETHPL.RXD3, ETHPL.RXEN, ETHPL.TXCLK, ETHPL.TXD0, ETHPL.TXD1, ETHPL.TXD2, ETHPL.TXD3, ETHPL.TXEN
differential pair: ETHPL.MDA_N, ETHPL.MDA_P, ETHPL.MDB_N, ETHPL.MDB_P, ETHPL.MDC_N, ETHPL.MDC_P, ETHPL.MDD_N, ETHPL.MDD_P, ETHPL.TDA_N, ETHPL.TDA_P, ETHPL.TDB_N, ETHPL.TDB_P, ETHPL.TDC_N, ETHPL.TDC_P, ETHPL.TDD_N, ETHPL.TDD_P
net class ETHPL_MDI; rule Maximum Via Count Constraint [Max Count = 2]; rule Matched Net Lengths [Delay Tolerance = 100ps]: ETHPL.MDA_N, ETHPL.MDA_P, ETHPL.MDB_N, ETHPL.MDB_P, ETHPL.MDC_N, ETHPL.MDC_P, ETHPL.MDD_N, ETHPL.MDD_P, ETHPL.TDA_N, ETHPL.TDA_P, ETHPL.TDB_N, ETHPL.TDB_P, ETHPL.TDC_N, ETHPL.TDC_P, ETHPL.TDD_N, ETHPL.TDD_P

### Notes on the sheet
- Debug ETH
- PNP FET to be utilized to generate the given additonal 1V2 rail for operations here. FET parameters were referenced to be similar to the one utilized in the chip's EVAL board
- Bulk capacitors referenced from design checklist AN. 1 100nF/10nF cap suggested per VDD pin alongside a 10uF cap per rail. Ferrite bead parameters were referenced from the EVAL board schematic
- C=2*(CL-Cs). Assuming Cs = 2pF and Cl of oscillator = 12pF, C= 20pF.
  Oscillator selected using the specs provided in the datasheet for DCR and frequency stability alongside load capacitance. Alternatively 830055474 from WE can also be used. Same footprint and specs but temperature range is only up till 85 degrees
- The chip utilizes internal termination for the drivers so line termination is not required given the trace lengths are not too long i.e <100mm. MDI lines should be impedance matched to 100ohm with a minimum differential trace gap on 0.4mm.
  MII lines to implement single ended impedance control as well at 50ohms on the PCB and to be delay tuned to 360ps skew between traces.  Both RX and TX CLK lines to have <10mm length difference between each other
- Additional stitching capacitors alongside noise supression ferrite. The ferrite need not be populated by default, it can be added to improve noise immunity
- 75ohm bob smith resistors to be added between center tap and and ISO GND of the ETH MDI lines. Additional high voltage stitching capacitor is suggested to additional protection and isolation
- The strap in RC circuit alongside a diode is required to be added as a safety measure for reset strap in circuit as the MAC and PHY logic voltages may not be the same regardless of them operating on near same logic levels
- The lower two bits of MODE lines to be configured for choosing the auto advertise mode. By default they are set to full duplex base 1000T as suggested in the table here. Populate the resistors @{"Id":"VYAFBZXI\FYZIORZR","ObjectType":2} and @{"Id":"VYAFBZXI\DURPVCQM","ObjectType":2} to 10k if the base mode is required to be changed refering to the table
- (in symbol Capacitor-SMD-0402) SMD 0402
- (in symbol Capacitor-SMD-0603) SMD 0603
- (in symbol Capacitor-SMD-0805) SMD 0805
- (in symbol FB_0603) SMD 0603
- (in symbol LFXTAL085881) 25MHz
- (in symbol Resistor-SMD-0402) SMD 0402

### Library data of the parts
C33-C35 C38-C41 C77 C80 C81 C84 C86 C90-C97 = Capacitor-SMD-0402: Capacitor SMD 0402 RATED
C36 C42 = Capacitor-SMD-0805: Capacitor SMD 0805 RATED
C37 C43 C82 C83 C85 C87 C88 = Capacitor-SMD-0603: Capacitor SMD 0603 RATED
D1 = 1N4448WQ-7-F: Diode 100V 4A; Manufacturer_Name: Diodes Incorporated; Datasheet Link: http://www.mouser.com/ds/2/115/ds12002-536532.pdf; Height: 1.35mm; Manufacturer_Part_Number: 1N4448WQ-7-F; Mouser Part Number: 621-1N4448WQ-7-F; Mouser Price/Stock: https://www.mouser.co.uk/ProductDetail/Diodes-Incorporated/1N4448WQ-7-F?qs=s5XU71A7K78gaRcR8oskdg%3D%3D; Arrow Part Number: 1N4448WQ-7-F; Arrow Price/Stock: https://www.arrow.com/en/products/1n4448wq-7-f/diodes-incorporated?utm_currency=USD&region=nac
FB1-FB5 = FB_0603: Ferrite Bead SMD 0603; Manufacturer: *; Manufacturer Part Number: *; Distributor Link: *; LCSC: *
IC10 = KSZ9031RNXIA: RGMII Ethernet Transceiver with VDDL LDO; Manufacturer_Name: Microchip; Datasheet Link: https://ww1.microchip.com/downloads/en/devicedoc/00002117f.pdf; Height: 0.9mm; Manufacturer_Part_Number: KSZ9031RNXIA; Mouser Part Number: 998-KSZ9031RNXIA; Mouser Price/Stock: https://www.mouser.co.uk/ProductDetail/Microchip-Technology/KSZ9031RNXIA?qs=lBdOJv1PVCGadCZMzb63mg%3D%3D; Arrow Part Number: KSZ9031RNXIA; Arrow Price/Stock: https://www.arrow.com/en/products/ksz9031rnxia/microchip-technology?region=europe
Q1 = SSM3J372R,LF: MOSFET (P-Channel); Manufacturer_Name: Toshiba; Datasheet Link: https://toshiba.semicon-storage.com/ap-en/semiconductor/product/mosfets/detail.SSM3J372R.html; Height: 0.88mm; Manufacturer_Part_Number: SSM3J372R,LF; Mouser Part Number: 757-SSM3J372RLF; Mouser Price/Stock: https://www.mouser.co.uk/ProductDetail/Toshiba/SSM3J372RLF?qs=u16ybLDytRbJaSMlwq9MLA%3D%3D; Arrow Part Number: SSM3J372R,LF; Arrow Price/Stock: null?utm_currency=USD&region=nac
R15-R34 = Resistor-SMD-0402: Resistor SMD 0402 RATED
T1 = HX5084NLT: Ethernet Signal Transformer; Manufacturer_Name: YAGEO; Datasheet Link: https://productfinder.pulseelectronics.com/api/open/part-attachments/datasheet/hx5084nlt; Height: 4.1402mm; Manufacturer_Part_Number: HX5084NLT; Mouser Part Number: 673-HX5084NLT; Mouser Price/Stock: https://www.mouser.co.uk/ProductDetail/Pulse-Electronics/HX5084NLT?qs=afupL77xwePI46UjbaB5Gg%3D%3D; Arrow Part Number: HX5084NLT; Arrow Price/Stock: https://www.arrow.com/en/products/hx5084nlt/pulse-electronics-corporation?utm_currency=USD&region=nac
Y1 = LFXTAL085881: Crystal Oscillator 25MHz; Manufacturer_Name: IDQ; Datasheet Link: https://www.mouser.in/datasheet/3/1460/1/LFXTAL085881.pdf; Height: 0.8mm; Manufacturer_Part_Number: LFXTAL085881

## Sheet RS485-Interface.SchDoc
size 279 x 320 mm; SheetNumber: 7; SheetTotal: 11
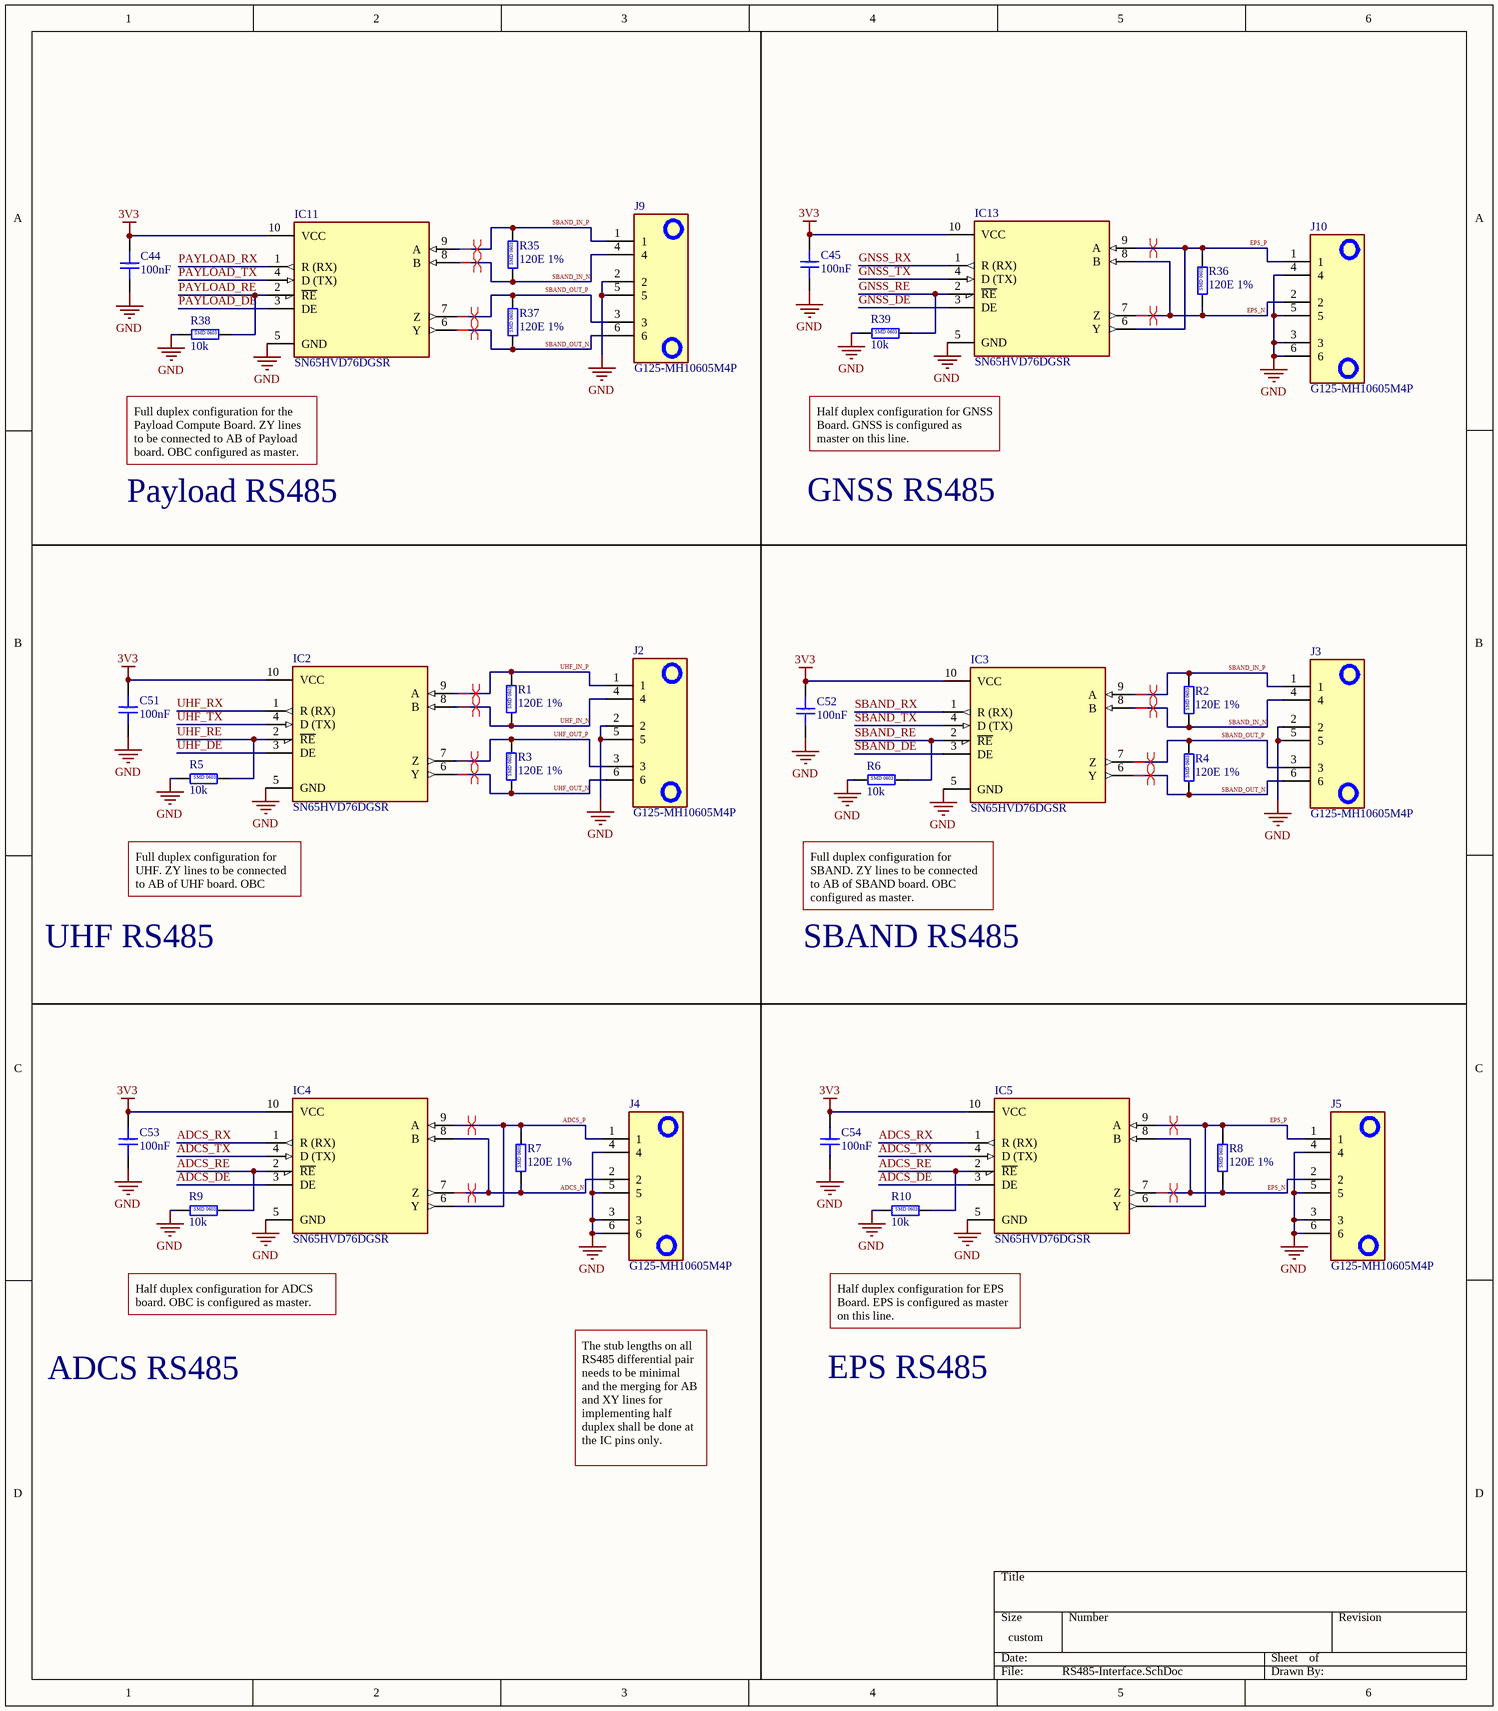
[diagram p6: RS485-Interface.SchDoc]

### Parts
C44  100nF  [CAP_0402]
C45  100nF  [CAP_0402]
C51  100nF  [CAP_0402]
C52  100nF  [CAP_0402]
C53  100nF  [CAP_0402]
C54  100nF  [CAP_0402]
IC2  SN65HVD76DGSR  [SOP50P490X110-10N]
IC3  SN65HVD76DGSR  [SOP50P490X110-10N]
IC4  SN65HVD76DGSR  [SOP50P490X110-10N]
IC5  SN65HVD76DGSR  [SOP50P490X110-10N]
IC11  SN65HVD76DGSR  [SOP50P490X110-10N]
IC13  SN65HVD76DGSR  [SOP50P490X110-10N]
J2  G125-MH10605M4P  [G125-MH10605M4P_1]
J3  G125-MH10605M4P  [G125-MH10605M4P_1]
J4  G125-MH10605M4P  [G125-MH10605M4P_1]
J5  G125-MH10605M4P  [G125-MH10605M4P_1]
J9  G125-MH10605M4P  [G125-MH10605M4P_1]
J10  G125-MH10605M4P  [G125-MH10605M4P_1]
R1  120E 1%  [RES_0603]
R2  120E 1%  [RES_0603]
R3  120E 1%  [RES_0603]
R4  120E 1%  [RES_0603]
R5  10k  [RES_0603]
R6  10k  [RES_0603]
R7  120E 1%  [RES_0603]
R8  120E 1%  [RES_0603]
R9  10k  [RES_0603]
R10  10k  [RES_0603]
R35  120E 1%  [RES_0603]
R36  120E 1%  [RES_0603]
R37  120E 1%  [RES_0603]
R38  10k  [RES_0603]
R39  10k  [RES_0603]

### Nets
3V3: C44.1 C45.1 C51.1 C52.1 C53.1 C54.1 IC2.10(VCC) IC3.10(VCC) IC4.10(VCC) IC5.10(VCC) IC11.10(VCC) IC13.10(VCC)
GND: C44.2 C45.2 C51.2 C52.2 C53.2 C54.2 IC2.5(GND) IC3.5(GND) IC4.5(GND) IC5.5(GND) IC11.5(GND) IC13.5(GND) J2.2 J2.5 J3.2 J3.5 J4.3 J4.4 J4.5 J4.6 J5.3 J5.4 J5.5 J5.6 J9.2 J9.5 J10.3 J10.4 J10.5 J10.6 R5.1 R6.1 R9.1 R10.1 R38.1 R39.1
ADCS_DE: IC4.3(DE) IC5.3(DE)
ADCS_N: IC4.7(Z) IC4.8(B) J4.2 R7.1
ADCS_P: IC4.6(Y) IC4.9(A) J4.1 R7.2
ADCS_RE: IC4.2(~{RE}) IC5.2(~{RE}) R9.2 R10.2
ADCS_RX: IC4.1(R_(RX)) IC5.1(R_(RX))
ADCS_TX: IC4.4(D_(TX)) IC5.4(D_(TX))
EPS_N: IC5.7(Z) IC5.8(B) IC13.7(Z) IC13.8(B) J5.2 J10.2 R8.1 R36.1
EPS_P: IC5.6(Y) IC5.9(A) IC13.6(Y) IC13.9(A) J5.1 J10.1 R8.2 R36.2
GNSS_DE: IC13.3(DE)
GNSS_RE: IC13.2(~{RE}) R39.2
GNSS_RX: IC13.1(R_(RX))
GNSS_TX: IC13.4(D_(TX))
PAYLOAD_DE: IC11.3(DE)
PAYLOAD_RE: IC11.2(~{RE}) R38.2
PAYLOAD_RX: IC11.1(R_(RX))
PAYLOAD_TX: IC11.4(D_(TX))
SBAND_DE: IC3.3(DE)
SBAND_IN_N: IC3.8(B) IC11.8(B) J3.4 J9.4 R2.1 R35.1
SBAND_IN_P: IC3.9(A) IC11.9(A) J3.1 J9.1 R2.2 R35.2
SBAND_OUT_N: IC3.6(Y) IC11.6(Y) J3.6 J9.6 R4.1 R37.1
SBAND_OUT_P: IC3.7(Z) IC11.7(Z) J3.3 J9.3 R4.2 R37.2
SBAND_RE: IC3.2(~{RE}) R6.2
SBAND_RX: IC3.1(R_(RX))
SBAND_TX: IC3.4(D_(TX))
UHF_DE: IC2.3(DE)
UHF_IN_N: IC2.8(B) J2.4 R1.1
UHF_IN_P: IC2.9(A) J2.1 R1.2
UHF_OUT_N: IC2.6(Y) J2.6 R3.1
UHF_OUT_P: IC2.7(Z) J2.3 R3.2
UHF_RE: IC2.2(~{RE}) R5.2
UHF_RX: IC2.1(R_(RX))
UHF_TX: IC2.4(D_(TX))

### Layout directives
differential pair: ADCS_N, ADCS_P, EPS_N, EPS_P, SBAND_IN_N, SBAND_IN_P, SBAND_OUT_N, SBAND_OUT_P, UHF_IN_N, UHF_IN_P, UHF_OUT_N, UHF_OUT_P

### Notes on the sheet
- Half duplex configuration for GNSS Board. GNSS is configured as master on this line.
- Payload RS485
- Full duplex configuration for the Payload Compute Board. ZY lines to be connected to AB of Payload board. OBC configured as master.
- GNSS RS485
- Full duplex configuration for UHF. ZY lines to be connected to AB of UHF board. OBC configured as master
- Full duplex configuration for SBAND. ZY lines to be connected to AB of SBAND board. OBC configured as master.
- UHF RS485
- SBAND RS485
- Half duplex configuration for ADCS board. OBC is configured as master.
- Half duplex configuration for EPS Board. EPS is configured as master on this line.
- ADCS RS485
- EPS RS485
- The stub lengths on all RS485 differential pair needs to be minimal and the merging for AB and XY lines for implementing half duplex shall be done at the IC pins only.
- (in symbol Capacitor-SMD-0402) SMD 0402
- (in symbol Resistor-SMD-0603) SMD 0603

### Library data of the parts
C44 C45 C51-C54 = Capacitor-SMD-0402: Capacitor SMD 0402 RATED
IC2-IC5 IC11 IC13 = SN65HVD76DGSR: RS485 Full Duplex Transciever; Manufacturer_Name: Texas Instruments; Datasheet Link: http://www.ti.com/lit/gpn/sn65hvd76; Height: 1.1mm; Manufacturer_Part_Number: SN65HVD76DGSR; Mouser Part Number: 595-SN65HVD76DGSR; Mouser Price/Stock: https://www.mouser.co.uk/ProductDetail/Texas-Instruments/SN65HVD76DGSR?qs=7z%252BmIopC6%2FI%252B8LLIzcebYw%3D%3D; Arrow Part Number: SN65HVD76DGSR; Arrow Price/Stock: https://www.arrow.com/en/products/sn65hvd76dgsr/texas-instruments?region=nac
J2-J5 J9 J10 = G125-MH10605M4P: Connector; Manufacturer_Name: Harwin; Datasheet Link: https://content.harwin.com/m/667f1be9427fb768/original/DRG-02921-Technical-Drawing-Datasheet-G125-MH1XX05M4P-pdf.pdf; Height: 5.3mm; Manufacturer_Part_Number: G125-MH10605M4P; Mouser Part Number: 855-G125MH1065M4PM4P; Mouser Price/Stock: https://www.mouser.co.uk/ProductDetail/Harwin/G125-MH10605M4P?qs=vHuUswq2%252BswF07IXFR1W6A%3D%3D
R1-R10 R35-R39 = Resistor-SMD-0603: Resistor SMD 0603 RATED

## Sheet EXT-Camera-Interface.SchDoc
size A4; SheetNumber: 8; SheetTotal: 11
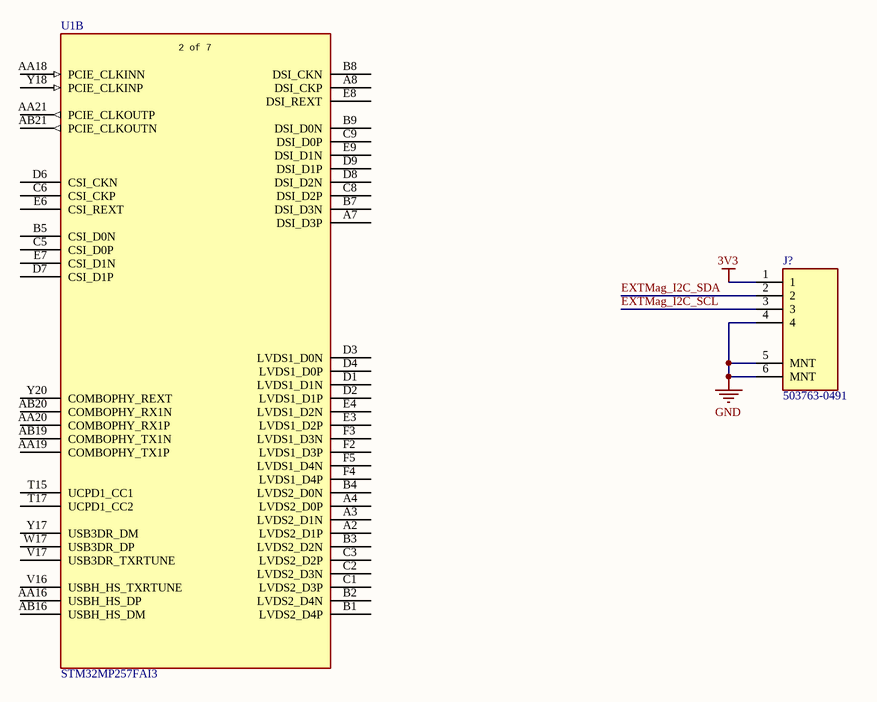
[diagram p7: EXT-Camera-Interface.SchDoc]

### Parts
J?  503763-0491  [5037630491]
U1  STM32MP257FAI3  [TFBGA436_STM]  (part B of 8)

### Nets
3V3: J?.1
GND: J?.4 J?.5(MNT) J?.6(MNT)
EXTMag_I2C_SCL: J?.3
EXTMag_I2C_SDA: J?.2

Not connected (* = marked no-connect by the designer): U1 A2(LVDS2_D1P) A3(LVDS2_D1N) A4(LVDS2_D0P) A7(DSI_D3P) A8(DSI_CKP) AA16(USBH_HS_DP) AA18(PCIE_CLKINN) AA19(COMBOPHY_TX1P) AA20(COMBOPHY_RX1P) AA21(PCIE_CLKOUTP) AB16(USBH_HS_DM) AB19(COMBOPHY_TX1N) AB20(COMBOPHY_RX1N) AB21(PCIE_CLKOUTN) B1(LVDS2_D4P) B2(LVDS2_D4N) B3(LVDS2_D2N) B4(LVDS2_D0N) B5(CSI_D0N) B7(DSI_D3N) B8(DSI_CKN) B9(DSI_D0N) C1(LVDS2_D3P) C2(LVDS2_D3N) C3(LVDS2_D2P) C5(CSI_D0P) C6(CSI_CKP) C8(DSI_D2P) C9(DSI_D0P) D1(LVDS1_D1N) D2(LVDS1_D1P) D3(LVDS1_D0N) D4(LVDS1_D0P) D6(CSI_CKN) D7(CSI_D1P) D8(DSI_D2N) D9(DSI_D1P) E3(LVDS1_D2P) E4(LVDS1_D2N) E6(CSI_REXT) E7(CSI_D1N) E8(DSI_REXT) E9(DSI_D1N) F2(LVDS1_D3P) F3(LVDS1_D3N) F4(LVDS1_D4P) F5(LVDS1_D4N) T15(UCPD1_CC1) T17(UCPD1_CC2) V16(USBH_HS_TXRTUNE) V17(USB3DR_TXRTUNE) W17(USB3DR_DP) Y17(USB3DR_DM) Y18(PCIE_CLKINP) Y20(COMBOPHY_REXT)

### Notes on the sheet
- (in symbol STM32MP257FAI3, part B) 2 of 7

### Library data of the parts
J? = 503763-0491: Connector; Manufacturer_Name: Molex; Datasheet Link: https://www.molex.com/webdocs/datasheets/pdf/en-us/5037630491_PCB_HEADERS.pdf; Height: 1mm; Manufacturer_Part_Number: 503763-0491; Mouser Part Number: 538-503763-0491; Mouser Price/Stock: https://www.mouser.co.uk/ProductDetail/Molex/503763-0491?qs=zwvsCB%2Fxu0cTZVAek%2FYVrQ%3D%3D
U1 = STM32MP257FAI3: as U1 on sheet MPU; Copyright: Copyright (C) 2025 Ultra Librarian. All rights reserved.; Manufacturer_Part_Number: STM32MP257FAI3; RefDes: RefDes; Type: Type

## Sheet Memory.SchDoc
size Legal; SheetNumber: 10; SheetTotal: 12
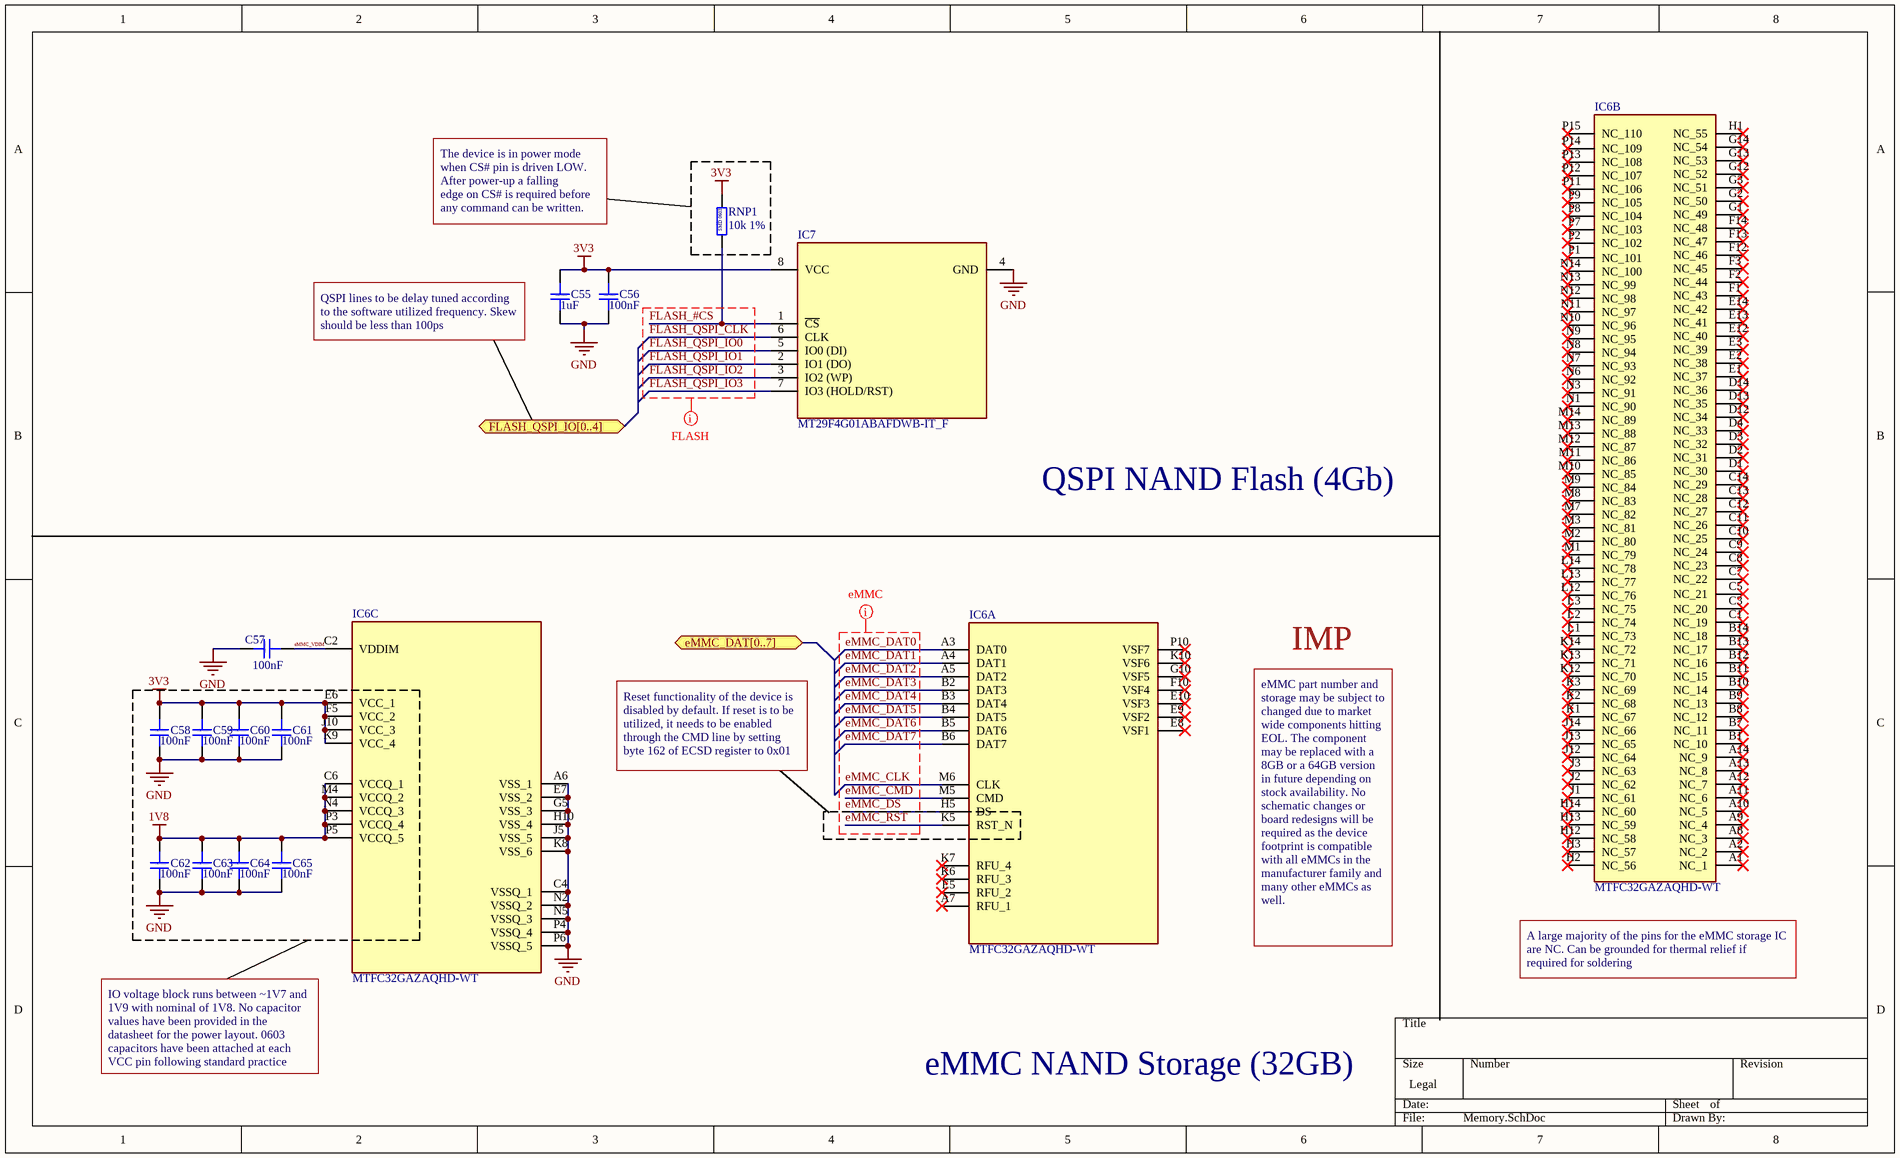
[diagram p8: Memory.SchDoc]

### Parts
C55  1uF  [CAP_0402]
C56  100nF  [CAP_0402]
C57  100nF  [CAP_0402]
C58  100nF  [CAP_0402]
C59  100nF  [CAP_0402]
C60  100nF  [CAP_0402]
C61  100nF  [CAP_0402]
C62  100nF  [CAP_0402]
C63  100nF  [CAP_0402]
C64  100nF  [CAP_0402]
C65  100nF  [CAP_0402]
IC6  MTFC32GAZAQHD-WT  [BGA153C50P14X14_1150X1300X90]  (parts A,B,C of 3)
IC7  MT29F4G01ABAFDWB-IT_F  [SON127P800X600X65-8N]
RNP1  10k 1%  [RES_0603]

### Ports
eMMC_DAT[0..7] (bidir), FLASH_QSPI_IO[0..4] (bidir)

### Nets
1V8: C62.1 C63.1 C64.1 C65.1 IC6.C6(VCCQ_1) IC6.M4(VCCQ_2) IC6.N4(VCCQ_3) IC6.P3(VCCQ_4) IC6.P5(VCCQ_5)
3V3: C55.1 C56.1 C58.1 C59.1 C60.1 C61.1 IC6.E6(VCC_1) IC6.F5(VCC_2) IC6.J10(VCC_3) IC6.K9(VCC_4) IC7.8(VCC) RNP1.2
GND: C55.2 C56.2 C57.1 C58.2 C59.2 C60.2 C61.2 C62.2 C63.2 C64.2 C65.2 IC6.A6(VSS_1) IC6.C4(VSSQ_1) IC6.E7(VSS_2) IC6.G5(VSS_3) IC6.H10(VSS_4) IC6.J5(VSS_5) IC6.K8(VSS_6) IC6.N2(VSSQ_2) IC6.N5(VSSQ_3) IC6.P4(VSSQ_4) IC6.P6(VSSQ_5) IC7.4(GND)
eMMC_CLK: IC6.M6(CLK)
eMMC_CMD: IC6.M5(CMD)
eMMC_DAT0: IC6.A3(DAT0)
eMMC_DAT1: IC6.A4(DAT1)
eMMC_DAT2: IC6.A5(DAT2)
eMMC_DAT3: IC6.B2(DAT3)
eMMC_DAT4: IC6.B3(DAT4)
eMMC_DAT5: IC6.B4(DAT5)
eMMC_DAT6: IC6.B5(DAT6)
eMMC_DAT7: IC6.B6(DAT7)
eMMC_DS: IC6.H5(DS)
eMMC_RST: IC6.K5(RST_N)
eMMC_VDIM: C57.2 IC6.C2(VDDIM)
FLASH_#CS: IC7.1(~{CS}) RNP1.1
FLASH_QSPI_CLK: IC7.6(CLK)
FLASH_QSPI_IO0: IC7.5(IO0_(DI))
FLASH_QSPI_IO1: IC7.2(IO1_(DO))
FLASH_QSPI_IO2: IC7.3(IO2_(WP))
FLASH_QSPI_IO3: IC7.7(IO3_(HOLD/RST))

Not connected (* = marked no-connect by the designer): IC6 A1(NC_1)* A2(NC_2)* A7(RFU_1)* A8(NC_3)* A9(NC_4)* A10(NC_5)* A11(NC_6)* A12(NC_7)* A13(NC_8)* A14(NC_9)* B1(NC_10)* B7(NC_11)* B8(NC_12)* B9(NC_13)* B10(NC_14)* B11(NC_15)* B12(NC_16)* B13(NC_17)* B14(NC_18)* C1(NC_19)* C3(NC_20)* C5(NC_21)* C7(NC_22)* C8(NC_23)* C9(NC_24)* C10(NC_25)* C11(NC_26)* C12(NC_27)* C13(NC_28)* C14(NC_29)* D1(NC_30)* D2(NC_31)* D3(NC_32)* D4(NC_33)* D12(NC_34)* D13(NC_35)* D14(NC_36)* E1(NC_37)* E2(NC_38)* E3(NC_39)* E5(RFU_2)* E8(VSF1)* E9(VSF2)* E10(VSF3)* E12(NC_40)* E13(NC_41)* E14(NC_42)* F1(NC_43)* F2(NC_44)* F3(NC_45)* F10(VSF4)* F12(NC_46)* F13(NC_47)* F14(NC_48)* G1(NC_49)* G2(NC_50)* G3(NC_51)* G10(VSF5)* G12(NC_52)* G13(NC_53)* G14(NC_54)* H1(NC_55)* H2(NC_56)* H3(NC_57)* H12(NC_58)* H13(NC_59)* H14(NC_60)* J1(NC_61)* J2(NC_62)* J3(NC_63)* J12(NC_64)* J13(NC_65)* J14(NC_66)* K1(NC_67)* K2(NC_68)* K3(NC_69)* K6(RFU_3)* K7(RFU_4)* K10(VSF6)* K12(NC_70)* K13(NC_71)* K14(NC_72)* L1(NC_73)* L2(NC_74)* L3(NC_75)* L12(NC_76)* L13(NC_77)* L14(NC_78)* M1(NC_79)* M2(NC_80)* M3(NC_81)* M7(NC_82)* M8(NC_83)* M9(NC_84)* M10(NC_85)* M11(NC_86)* M12(NC_87)* M13(NC_88)* M14(NC_89)* N1(NC_90)* N3(NC_91)* N6(NC_92)* N7(NC_93)* N8(NC_94)* N9(NC_95)* N10(NC_96)* N11(NC_97)* N12(NC_98)* N13(NC_99)* N14(NC_100)* P1(NC_101)* P2(NC_102)* P7(NC_103)* P8(NC_104)* P9(NC_105)* P10(VSF7)* P11(NC_106)* P12(NC_107)* P13(NC_108)* P14(NC_109)* P15(NC_110)*

### Layout directives
net class eMMC: eMMC_CLK, eMMC_CMD, eMMC_DAT0, eMMC_DAT1, eMMC_DAT2, eMMC_DAT3, eMMC_DAT4, eMMC_DAT5, eMMC_DAT6, eMMC_DAT7, eMMC_DS, eMMC_RST
net class FLASH; rule Maximum Via Count Constraint [Max Count = 2]; rule Matched Net Lengths [Delay Tolerance = 100ps]: FLASH_#CS, FLASH_QSPI_CLK, FLASH_QSPI_IO0, FLASH_QSPI_IO1, FLASH_QSPI_IO2, FLASH_QSPI_IO3

### Notes on the sheet
- The device is in power mode when CS# pin is driven LOW. After power-up a falling
  edge on CS# is required before any command can be written.
- (near C55) QSPI lines to be delay tuned according to the software utilized frequency. Skew should be less than 100ps
- QSPI NAND Flash (4Gb)
- IMP
- Reset functionality of the device is disabled by default. If reset is to be utilized, it needs to be enabled through the CMD line by setting byte 162 of ECSD register to 0x01
- eMMC part number and storage may be subject to changed due to market wide components hitting EOL. The component may be replaced with a 8GB or a 64GB version in future depending on stock availability. No schematic changes or board redesigns will be required as the device footprint is compatible with all eMMCs in the manufacturer family and many other eMMCs as well.
- A large majority of the pins for the eMMC storage IC are NC. Can be grounded for thermal relief if required for soldering
- (near IC6) IO voltage block runs between ~1V7 and 1V9 with nominal of 1V8. No capacitor values have been provided in the datasheet for the power layout. 0603 capacitors have been attached at each VCC pin following standard practice
- eMMC NAND Storage (32GB)
- (in symbol Capacitor-SMD-0402) SMD 0402
- (in symbol Resistor-SMD-0603) SMD 0603

### Library data of the parts
C55-C65 = Capacitor-SMD-0402: Capacitor SMD 0402 RATED
IC6 = MTFC32GAZAQHD-WT: Integrated Circuit; Manufacturer_Name: Micron; Datasheet Link: https://4donline.ihs.com/images/VipMasterIC/IC/MICT/MICT-S-A0013760855/MICT-S-A0013760855-1.pdf?hkey=52A5661711E402568146F3353EA87419; Height: 0.9mm; Manufacturer_Part_Number: MTFC32GAZAQHD-WT; Mouser Part Number: 340-531307-TRAY; Mouser Price/Stock: https://www.mouser.co.uk/ProductDetail/Micron/MTFC32GAZAQHD-WT?qs=KUoIvG%2F9IlZhoMlKy7eeFw%3D%3D; Arrow Part Number: MTFC32GAZAQHD-WT; Arrow Price/Stock: https://www.arrow.com/en/products/mtfc32gazaqhd-wt/micron-technology?utm_currency=USD&region=nac
IC7 = MT29F4G01ABAFDWB-IT_F: Integrated Circuit; Manufacturer_Name: Micron; Manufacturer_Part_Number: MT29F4G01ABAFDWB-IT:F; Datasheet Link: https://www.farnell.com/datasheets/3151403.pdf; Height: 0.65mm; Mouser Part Number: 340-359563; Mouser Price/Stock: https://www.mouser.co.uk/ProductDetail/Micron/MT29F4G01ABAFDWB-ITF?qs=wUXugUrL1qwrjb7To7JPbA%3D%3D; Arrow Part Number: MT29F4G01ABAFDWB-IT:F; Arrow Price/Stock: null?region=nac
RNP1 = Resistor-SMD-0603: Resistor SMD 0603 RATED

## Sheet Sensors.SchDoc
size 300 x 219 mm; SheetNumber: 11; SheetTotal: 12
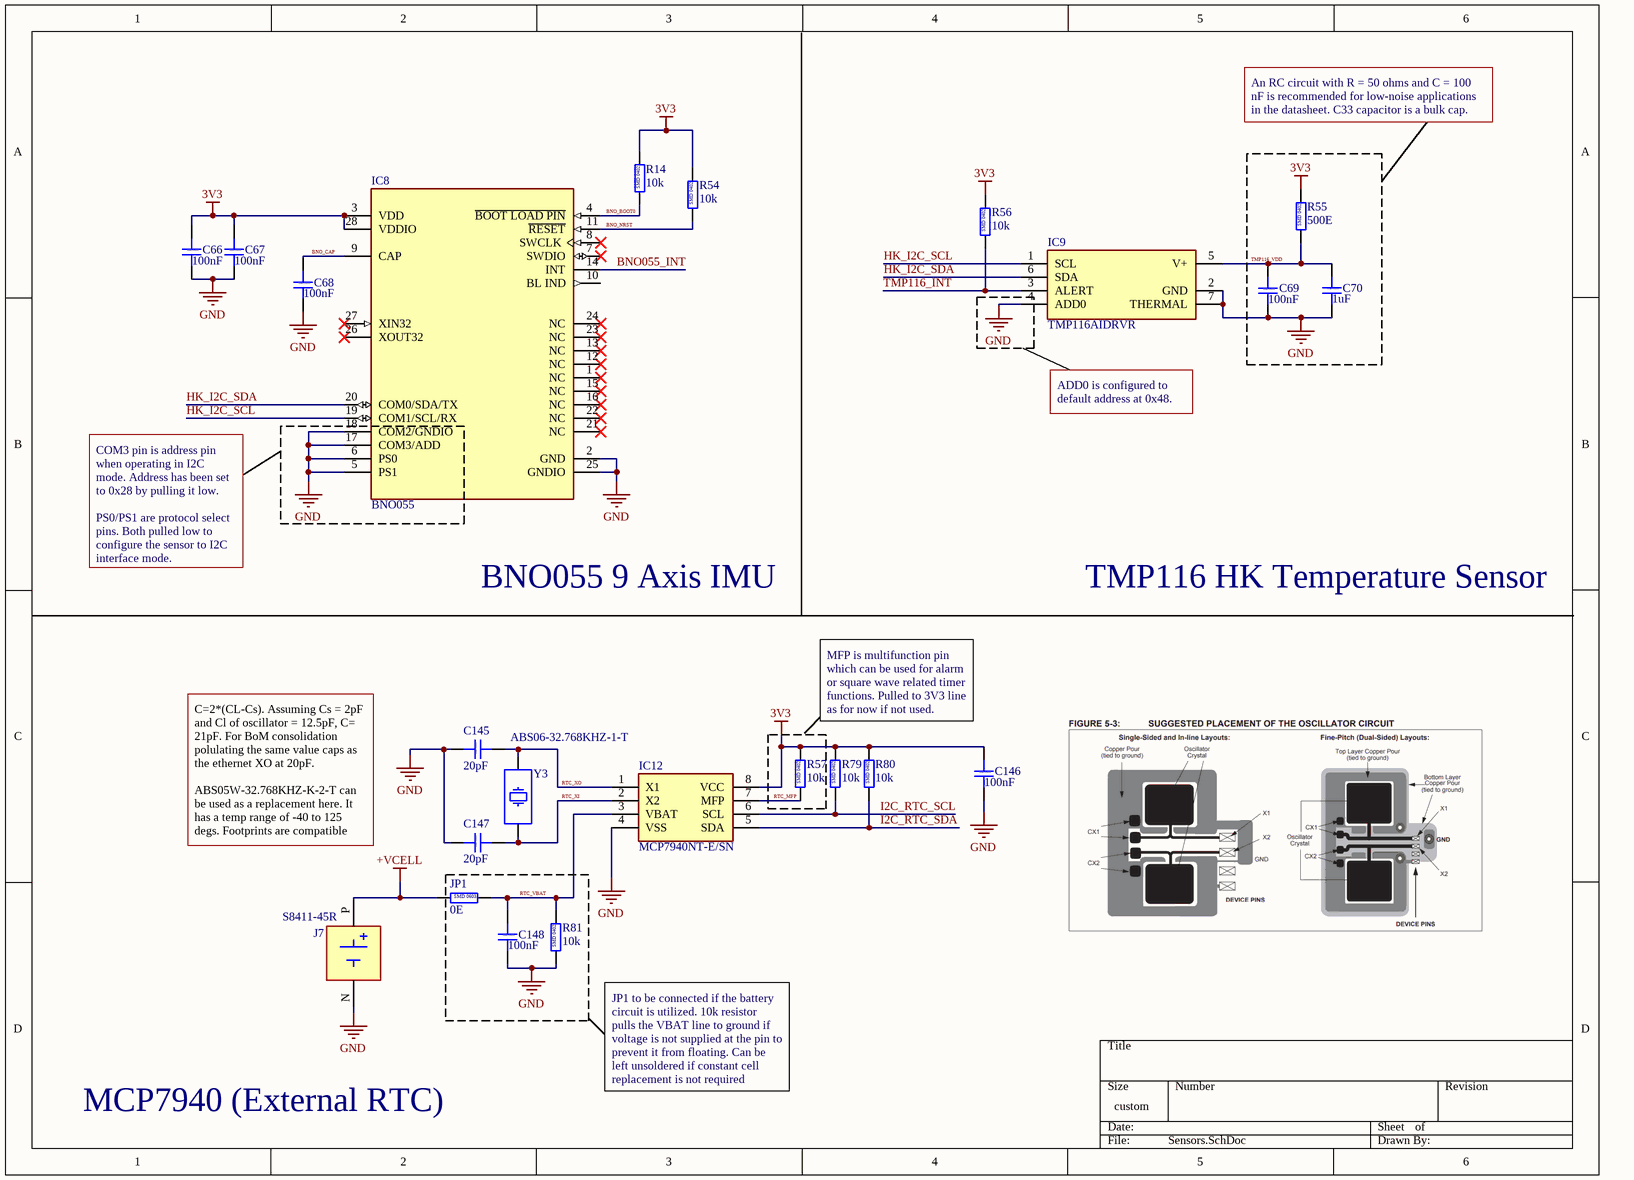
[diagram p9: Sensors.SchDoc]

### Parts
C66  100nF  [CAP_0402]
C67  100nF  [CAP_0402]
C68  100nF  [CAP_0402]
C69  100nF  [CAP_0402]
C70  1uF  [CAP_0402]
C145  20pF  [CAP_0402]
C146  100nF  [CAP_0402]
C147  20pF  [CAP_0402]
C148  100nF  [CAP_0402]
IC8  BNO055  [BNO0XX]
IC9  TMP116AIDRVR  [SON65P200X200X80-7N]
IC12  MCP7940NT-E/SN  [SOIC127P600X175-8N]
J7  S8411-45R  [HARWIN_S8411-45R]
JP1  0E  [RES_0603]
R14  10k  [RES_0402]
R54  10k  [RES_0402]
R55  500E  [RES_0402]
R56  10k  [RES_0402]
R57  10k  [RES_0402]
R79  10k  [RES_0402]
R80  10k  [RES_0402]
R81  10k  [RES_0402]
Y3  ABS06-32.768KHZ-1-T  [ABS06]

### Nets
3V3: C66.1 C67.1 C146.1 IC8.3(VDD) IC8.28(VDDIO) IC12.8(VCC) R14.2 R54.2 R55.2 R56.2 R57.2 R79.2 R80.2
+VCELL: J7.P(POS) JP1.1
GND: C66.2 C67.2 C68.2 C69.2 C70.2 C145.1 C146.2 C147.1 C148.2 IC8.2(GND) IC8.5(PS1) IC8.6(PS0) IC8.17(COM3/ADD) IC8.18(COM2/GNDIO) IC8.25(GNDIO) IC9.2(GND) IC9.4(ADD0) IC9.7(THERMAL) IC12.4(VSS) J7.N(NEG) R81.1
BNO055_INT: IC8.14(INT)
BNO_BOOT0: IC8.4(~{BOOT_LOAD_PIN}) R14.1
BNO_CAP: C68.1 IC8.9(CAP)
BNO_NRST: IC8.11(~{RESET}) R54.1
HK_I2C_SCL: IC8.19(COM1/SCL/RX) IC9.1(SCL)
HK_I2C_SDA: IC8.20(COM0/SDA/TX) IC9.6(SDA)
I2C_RTC_SCL: IC12.6(SCL) R79.1
I2C_RTC_SDA: IC12.5(SDA) R80.1
RTC_MFP: IC12.7(MFP) R57.1
RTC_VBAT: C148.1 IC12.3(VBAT) JP1.2 R81.2
RTC_XI: C147.2 IC12.2(X2) Y3.1
RTC_XO: C145.2 IC12.1(X1) Y3.2
TMP116_INT: IC9.3(ALERT) R56.1
TMP116_VDD: C69.1 C70.1 IC9.5(V+) R55.1

Not connected (* = marked no-connect by the designer): IC8 1(NC)* 7(SWDIO)* 8(SWCLK)* 10(BL_IND) 12(NC)* 13(NC)* 15(NC)* 16(NC)* 21(NC)* 22(NC)* 23(NC)* 24(NC)* 26(XOUT32)* 27(XIN32)*

### Notes on the sheet
- An RC circuit with R = 50 ohms and C = 100 nF is recommended for low-noise applications in the datasheet. C33 capacitor is a bulk cap.
- ADD0 is configured to default address at 0x48.
- COM3 pin is address pin when operating in I2C mode. Address has been set to 0x28 by pulling it low.
  PS0/PS1 are protocol select pins. Both pulled low to configure the sensor to I2C interface mode.
- BNO055 9 Axis IMU
- TMP116 HK Temperature Sensor
- MFP is multifunction pin which can be used for alarm or square wave related timer functions. Pulled to 3V3 line as for now if not used.
- C=2*(CL-Cs). Assuming Cs = 2pF and Cl of oscillator = 12.5pF, C= 21pF. For BoM consolidation polulating the same value caps as the ethernet XO at 20pF.
  ABS05W-32.768KHZ-K-2-T can be used as a replacement here. It has a temp range of -40 to 125 degs. Footprints are compatible
- MCP7940 (External RTC)
- JP1 to be connected if the battery circuit is utilized. 10k resistor pulls the VBAT line to ground if voltage is not supplied at the pin to prevent it from floating. Can be left unsoldered if constant cell replacement is not required
- (in symbol Capacitor-SMD-0402) SMD 0402
- (in symbol Resistor-SMD-0402) SMD 0402
- (in symbol Resistor-SMD-0603) SMD 0603

### Library data of the parts
C66-C70 C145-C148 = Capacitor-SMD-0402: Capacitor SMD 0402 RATED
IC9 = TMP116AIDRVR: Integrated Circuit; Manufacturer_Name: Texas Instruments; Datasheet Link: http://www.ti.com/lit/gpn/tmp116; Height: 0.8mm; Manufacturer_Part_Number: TMP116AIDRVR; Mouser Part Number: 595-TMP116AIDRVR; Mouser Price/Stock: https://www.mouser.co.uk/ProductDetail/Texas-Instruments/TMP116AIDRVR?qs=gt1LBUVyoHkC4iqK5Vip8g%3D%3D; Arrow Part Number: TMP116AIDRVR; Arrow Price/Stock: https://www.arrow.com/en/products/tmp116aidrvr/texas-instruments?utm_currency=USD&region=nac
IC12 = MCP7940NT-I_SN: Integrated Circuit; Manufacturer_Name: Microchip; Manufacturer_Part_Number: MCP7940NT-I/SN; Datasheet Link: http://www.microchip.com/mymicrochip/filehandler.aspx?ddocname=en553487; Height: 1.75mm; Mouser Part Number: 579-MCP7940NT-I/SN; Mouser Price/Stock: https://www.mouser.co.uk/ProductDetail/Microchip-Technology/MCP7940NT-I-SN?qs=o%2FJGMiCJeCObBF3PnsLA7Q%3D%3D; Arrow Part Number: MCP7940NT-I/SN; Arrow Price/Stock: https://www.arrow.com/en/products/mcp7940nt-isn/microchip-technology?region=nac
J7 = S8411-45R: Coin Cell Battery Retainer, Horizontal SMT, for CR1220 Coin Cell Batteries, Tape & Reeled; MF: Harwin; SnapEDA_Link: https://www.snapeda.com/parts/S8411-45R/Harwin+Inc./view-part/?ref=snap; Package: None; Value: *; MP: S8411-45R; Check_prices: https://www.snapeda.com/parts/S8411-45R/Harwin+Inc./view-part/?ref=eda
JP1 = Resistor-SMD-0603: Resistor SMD 0603 RATED
R14 R54-R57 R79-R81 = Resistor-SMD-0402: Resistor SMD 0402 RATED
Y3 = ABS06-32.768KHZ-1-T: Crystal or Oscillator; Manufacturer_Name: ABRACON; Datasheet Link: https://abracon.com/Resonators/ABS06.pdf; Height: 0.6mm; Manufacturer_Part_Number: ABS06-32.768KHZ-1-T; Mouser Part Number: 815-ABS06-32.7K-1-T; Mouser Price/Stock: https://www.mouser.co.uk/ProductDetail/ABRACON/ABS06-32.768KHZ-1-T?qs=3LVMET7lfiOVpH4K9yAPuw%3D%3D; Arrow Part Number: ABS06-32.768KHZ-1-T; Arrow Price/Stock: https://www.arrow.com/en/products/abs06-32.768khz-1-t/abracon?utm_currency=USD&region=nac

## Sheet Harness.SchDoc
size A4; SheetNumber: 10; SheetTotal: 10
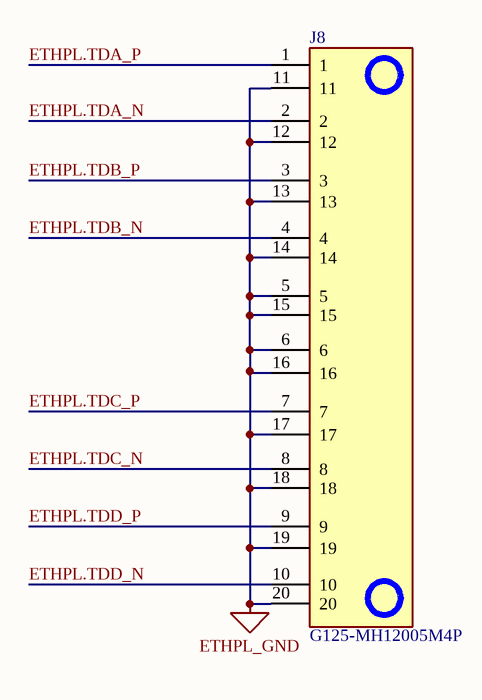
[diagram p10: Harness.SchDoc]

### Parts
J8  G125-MH12005M4P  [G125-MH12005M4P_1]

### Nets
ETHPL_GND: J8.5 J8.6 J8.11 J8.12 J8.13 J8.14 J8.15 J8.16 J8.17 J8.18 J8.19 J8.20
ETHPL.TDA_N: J8.2
ETHPL.TDA_P: J8.1
ETHPL.TDB_N: J8.4
ETHPL.TDB_P: J8.3
ETHPL.TDC_N: J8.8
ETHPL.TDC_P: J8.7
ETHPL.TDD_N: J8.10
ETHPL.TDD_P: J8.9

### Library data of the parts
J8 = G125-MH12005M4P: Connector; Manufacturer_Name: Harwin; Datasheet Link: https://content.harwin.com/m/667f1be9427fb768/original/DRG-02921-Technical-Drawing-Datasheet-G125-MH1XX05M4P-pdf.pdf; Height: 5.3mm; Manufacturer_Part_Number: G125-MH12005M4P; Mouser Part Number: 855-G125MH1205M4PM4P; Mouser Price/Stock: https://www.mouser.co.uk/ProductDetail/Harwin/G125-MH12005M4P?qs=vHuUswq2%252Bsy%252BkqY0DryK%2FQ%3D%3D

## Nets that join several sheets
1V8: PMIC (5 pins), Memory (9 pins)
3V3: PMIC (5 pins), DebugInterface (J6.5), ETH-Debug (6 pins), RS485-Interface (12 pins), EXT-Camera-Interface (J?.1), Memory (12 pins), Sensors (13 pins)
ETHPL_GND: ETH-Debug (9 pins), Harness (12 pins)
GND: PMIC (50 pins), DebugInterface (J6.1 J6.7 J6.8), ETH-Debug (37 pins), RS485-Interface (36 pins), EXT-Camera-Interface (J?.4 J?.5 J?.6), Memory (23 pins), Sensors (21 pins)
ETHPL.TDA_N: ETH-Debug (T1.12), Harness (J8.2)
ETHPL.TDA_P: ETH-Debug (T1.11), Harness (J8.1)
ETHPL.TDB_N: ETH-Debug (T1.9), Harness (J8.4)
ETHPL.TDB_P: ETH-Debug (T1.8), Harness (J8.3)
ETHPL.TDC_N: ETH-Debug (T1.6), Harness (J8.8)
ETHPL.TDC_P: ETH-Debug (T1.5), Harness (J8.7)
ETHPL.TDD_N: ETH-Debug (T1.3), Harness (J8.10)
ETHPL.TDD_P: ETH-Debug (T1.2), Harness (J8.9)